# EAGLE design stm32f407 (EAGLE 9.6.2)
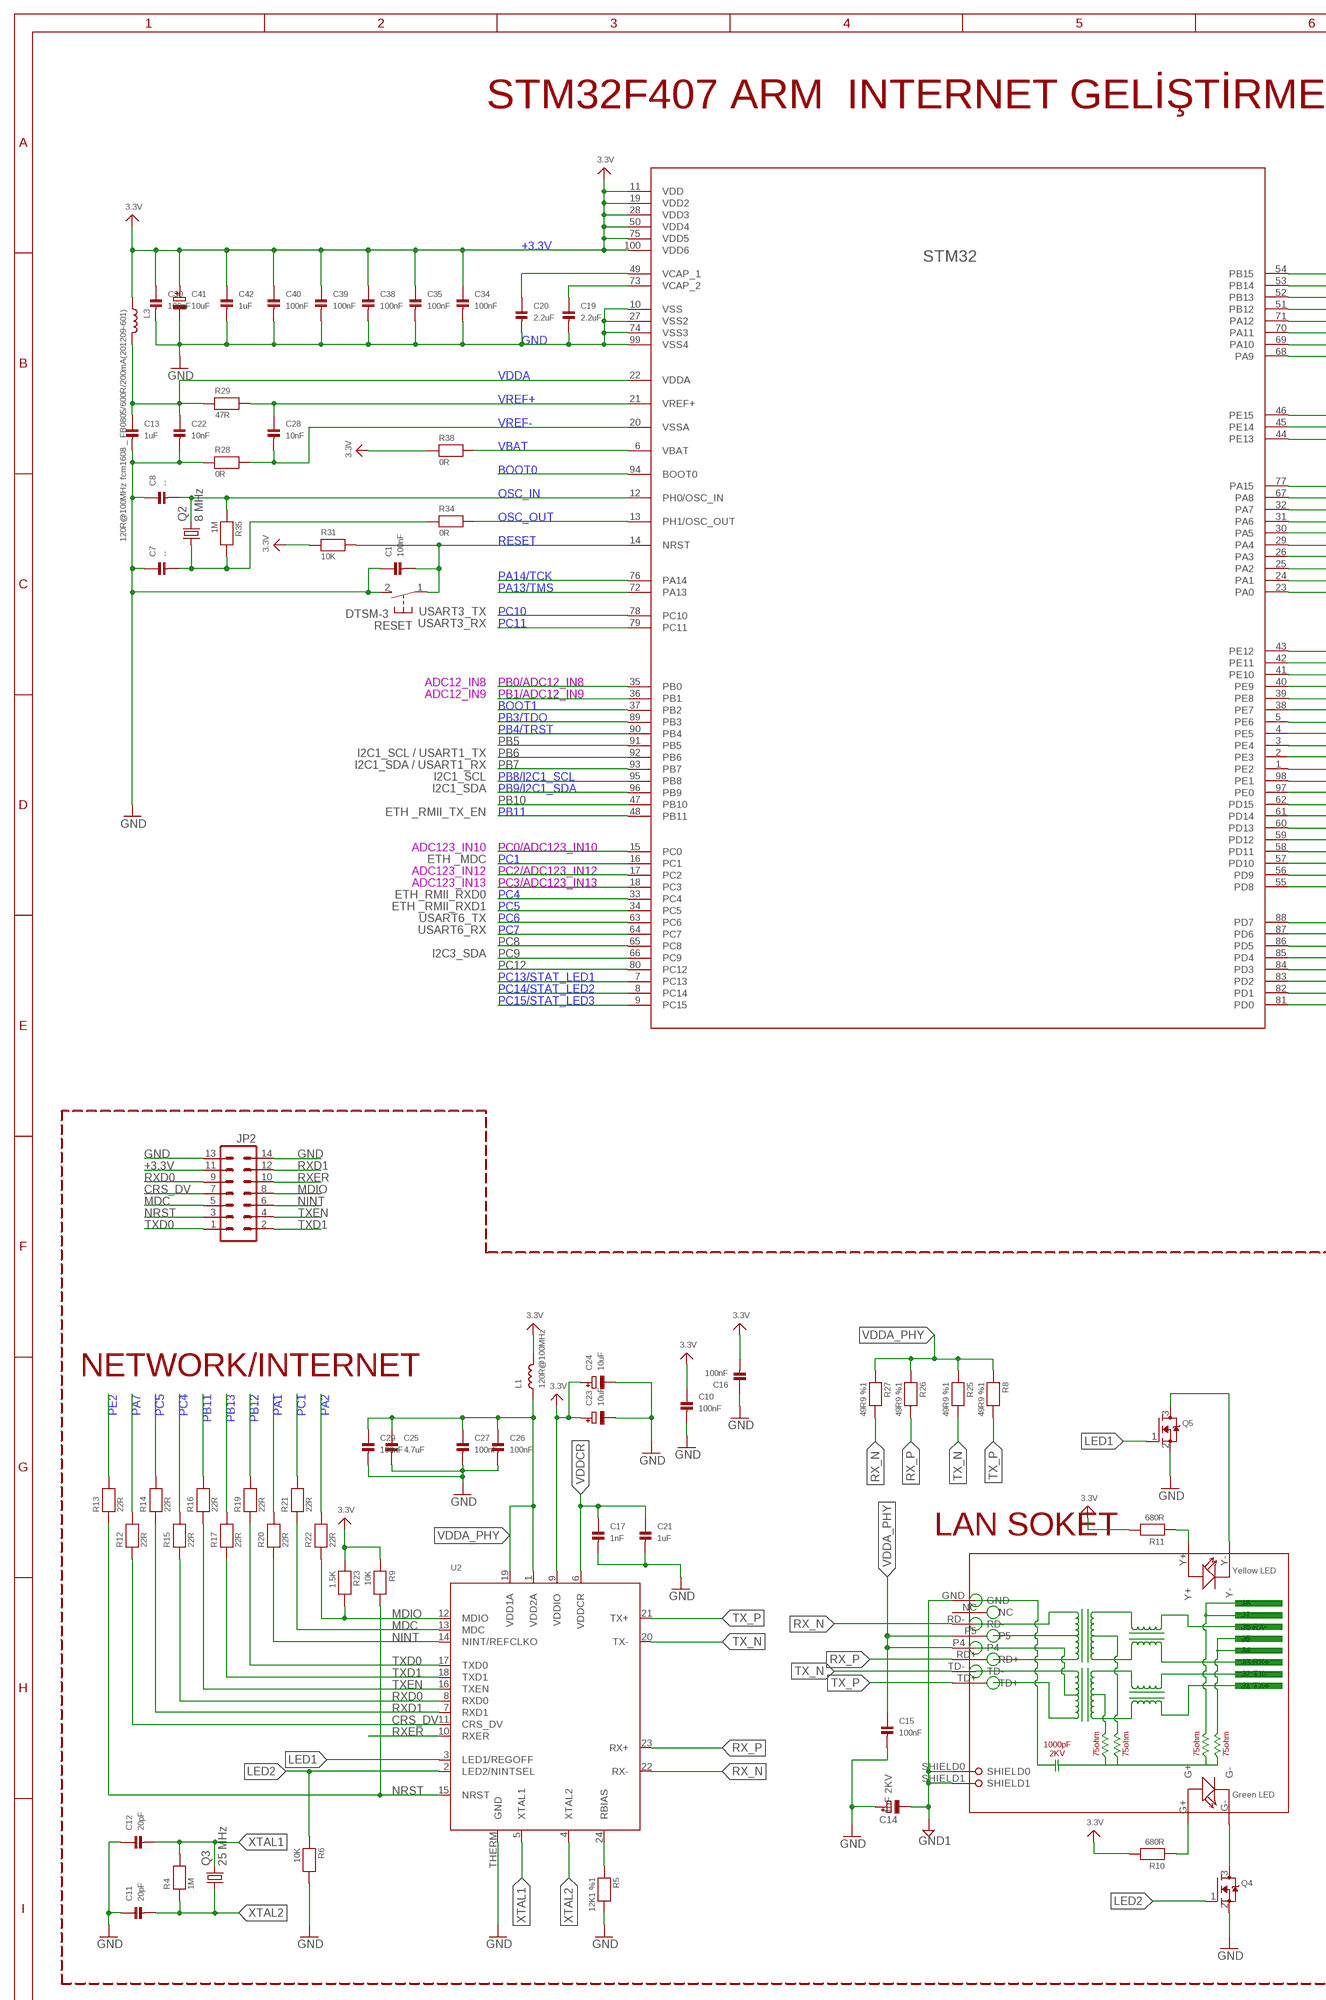
[diagram p0: schematic, sheet 1, part 1 of 2]
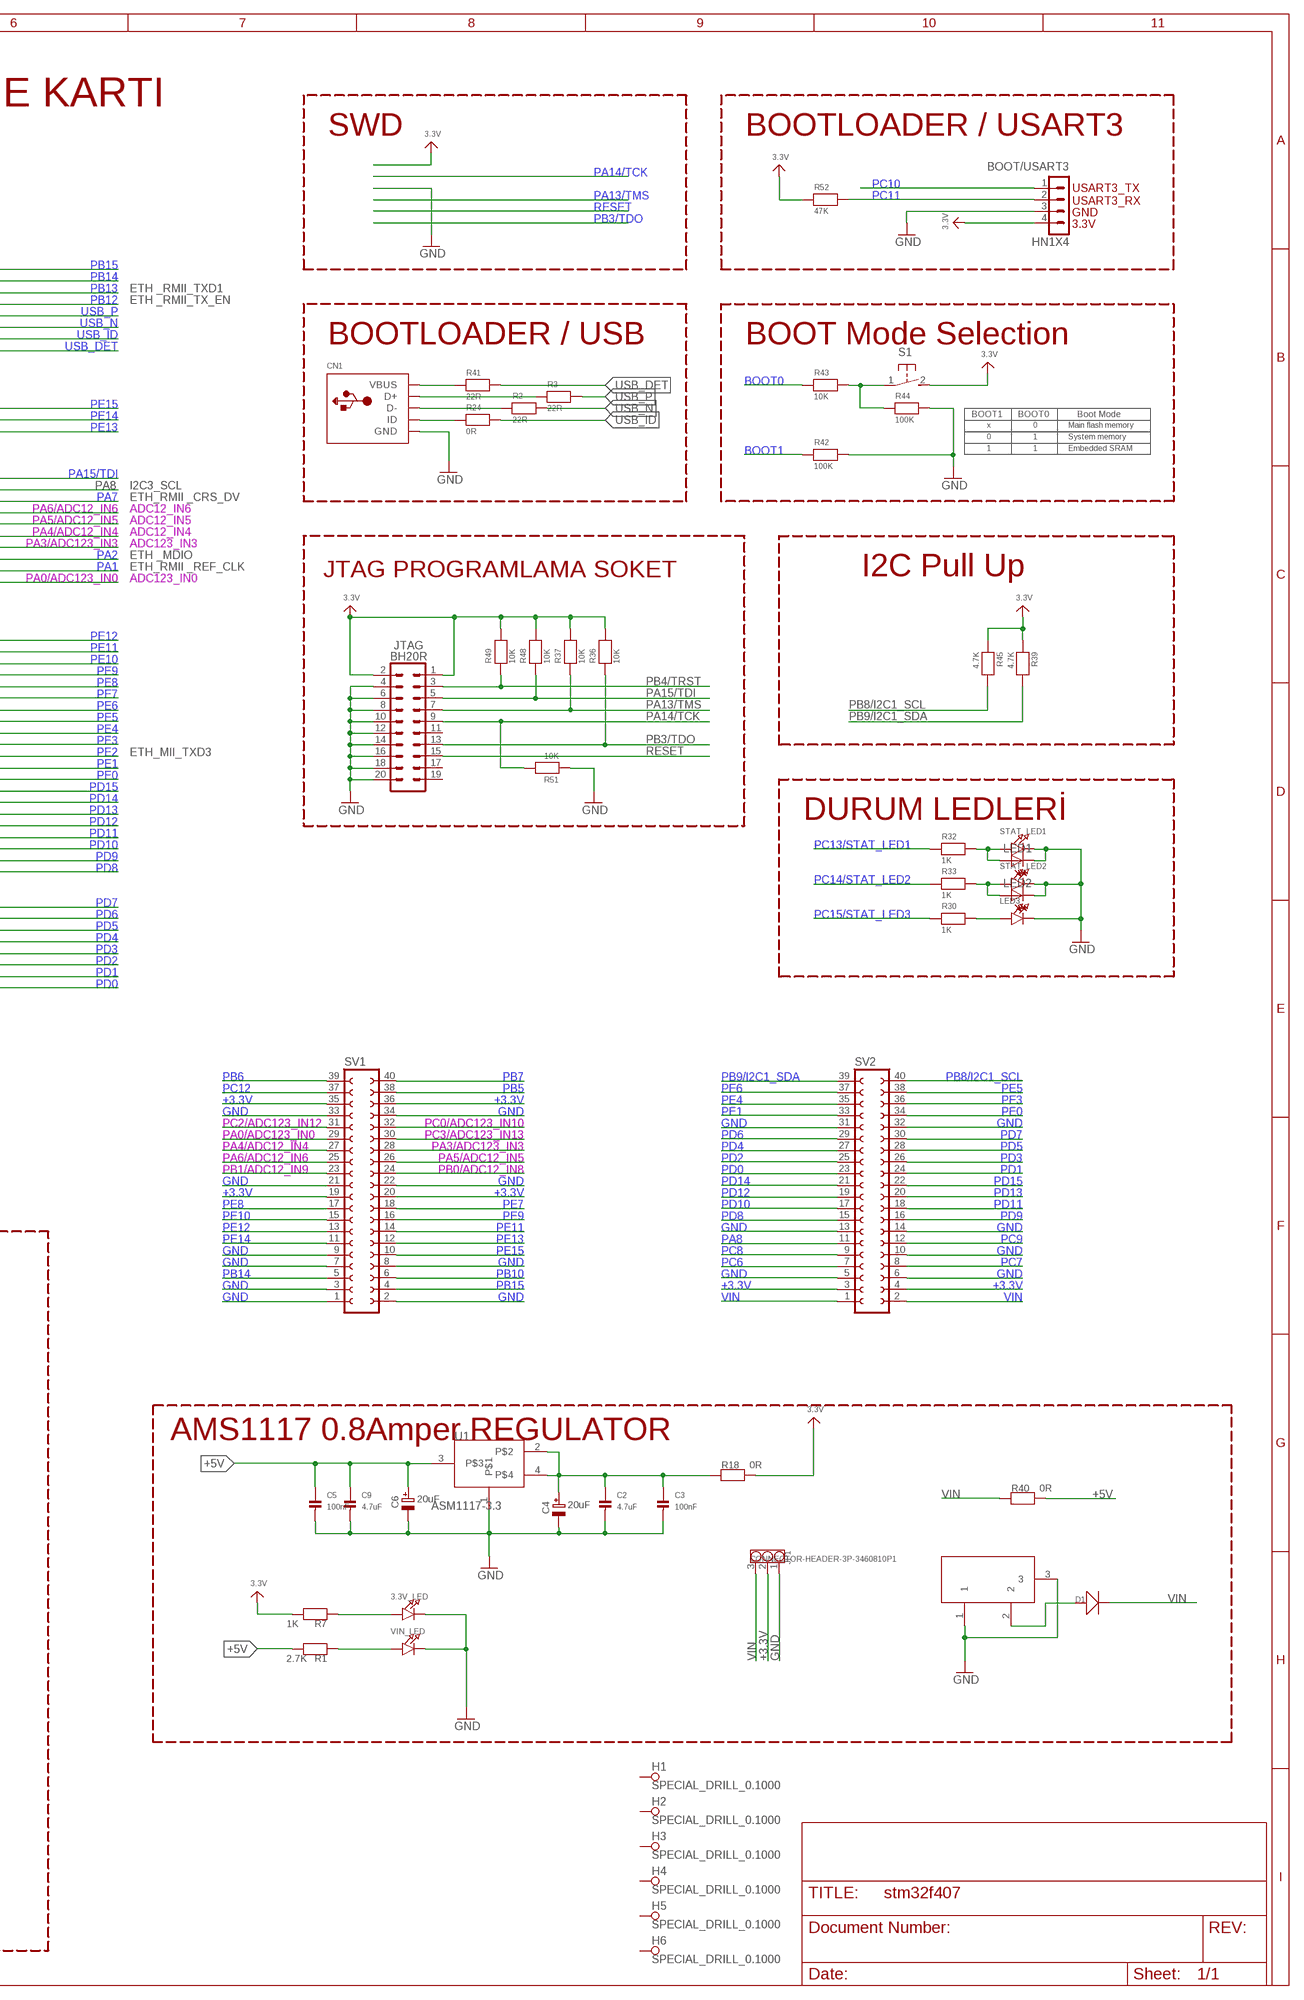
[diagram p1: schematic, sheet 1, part 2 of 2]

## Parts
3.3V_LED  LED0805  [CHIPLED_0805]
BOOT/USART3  HN1X4  CON4HN1X4  [HN1X4]
C1  100nF  CAP_CERAMIC_0603  [_0603]
C2  4.7uF  CAP_CERAMIC0805  [0805]
C3  100nF  CAP_CERAMIC0805  [0805]
C4  20uF  CAP_TANTALUMB/3528_REFLOW  [EIA3528-21/B-R]
C5  100nF  CAP_CERAMIC0805  [0805]
C6  20uF  CAP_TANTALUMB/3528_REFLOW  [EIA3528-21/B-R]
C7  --  CAP_CERAMIC_0603  [_0603]
C8  --  CAP_CERAMIC_0603  [_0603]
C9  4.7uF  CAP_CERAMIC0805  [0805]
C10  100nF  CAP_CERAMIC_0603  [_0603]
C11  20pF  CAP_CERAMIC_0603  [_0603]
C12  20pF  CAP_CERAMIC_0603  [_0603]
C13  1uF  CAP_CERAMIC_0805  [_0805]
C14  1nF 2KV  CAP_TANTALUMB/3528_REFLOW  [EIA3528-21/B-R]
C15  100nF  CAP_CERAMIC_0805  [_0805]
C16  100nF  CAP_CERAMIC_0603  [_0603]
C17  1nF  CAP_CERAMIC_0603  [_0603]
C19  2.2uF  CAP_CERAMIC1206  [1206]
C20  2.2uF  CAP_CERAMIC1206  [1206]
C21  1uF  CAP_CERAMIC_0805  [_0805]
C22  10nF  CAP_CERAMIC_0603  [_0603]
C23  10uF  CAP_TANTALUMB/3528_REFLOW  [EIA3528-21/B-R]
C24  10uF  CAP_TANTALUMB/3528_REFLOW  [EIA3528-21/B-R]
C25  4.7uF  CAP_CERAMIC_0805  [_0805]
C26  100nF  CAP_CERAMIC_0603  [_0603]
C27  100nF  CAP_CERAMIC_0603  [_0603]
C28  10nF  CAP_CERAMIC_0603  [_0603]
C29  100nF  CAP_CERAMIC_0603  [_0603]
C30  100nF  CAP_CERAMIC_0603  [_0603]
C34  100nF  CAP_CERAMIC_0603  [_0603]
C35  100nF  CAP_CERAMIC_0603  [_0603]
C38  100nF  CAP_CERAMIC_0603  [_0603]
C39  100nF  CAP_CERAMIC_0603  [_0603]
C40  100nF  CAP_CERAMIC_0603  [_0603]
C41  10uF  CAP_TANTALUMB/3528_REFLOW  [EIA3528-21/B-R]
C42  1uF  CAP_CERAMIC_0805  [_0805]
CN1  USBMINIBLARGE  [USB-MINIB_LARGER]
D1  D-D1206  [LL-34]
H1  SPECIAL_DRILL_0.1000  [PAD_0.1000]
H2  SPECIAL_DRILL_0.1000  [PAD_0.1000]
H3  SPECIAL_DRILL_0.1000  [PAD_0.1000]
H4  SPECIAL_DRILL_0.1000  [PAD_0.1000]
H5  SPECIAL_DRILL_0.1000  [PAD_0.1000]
H6  SPECIAL_DRILL_0.1000  [PAD_0.1000]
JP1  CONNECTOR-HEADER-3P-3460810P1  [1X3P-2.54-2.54-11.6-3.0-BLACK-MALE]
JP2  MA07-2  [MA07-2]
JTAG  BH20R  ML20R  [BH20R]
L1  120R@100MHz  INDUCTOR_0805  [_0805]
L3  120R@100MHz fcm1608 _ FB0805/600R/200mA(201209-601)  INDUCTOR_0805  [_0805]
LED1  LED5MM  [LED5MM]
LED2  LED5MM  [LED5MM]
LED3  LED0805  [CHIPLED_0805]
Q2  8 MHz  CRYSTALHC49UP  [HC49UP]
Q3  25 MHz  CRYSTALHC49UP  [HC49UP]
Q4  MOSFET-NWIDE  [SOT23-WIDE]
Q5  MOSFET-NWIDE  [SOT23-WIDE]
R1  2.7K  RESISTOR_0603  [_0603]
R2  22R  RESISTOR_0603  [_0603]
R3  22R  RESISTOR_0603  [_0603]
R4  1M  RESISTOR_0603  [_0603]
R5  12K1 %1  RESISTOR_0603  [_0603]
R6  10K  RESISTOR_0603  [_0603]
R7  1K  RESISTOR_0603  [_0603]
R8  49R9 %1  RESISTOR_0603  [_0603]
R9  10K  RESISTOR_0603  [_0603]
R10  680R  RESISTOR_0805  [_0805]
R11  680R  RESISTOR_0805  [_0805]
R12  22R  RESISTOR_0603  [_0603]
R13  22R  RESISTOR_0603  [_0603]
R14  22R  RESISTOR_0603  [_0603]
R15  22R  RESISTOR_0603  [_0603]
R16  22R  RESISTOR_0603  [_0603]
R17  22R  RESISTOR_0603  [_0603]
R18  0R  RESISTOR0805  [0805]
R19  22R  RESISTOR_0603  [_0603]
R20  22R  RESISTOR_0603  [_0603]
R21  22R  RESISTOR_0603  [_0603]
R22  22R  RESISTOR_0603  [_0603]
R23  1.5K  RESISTOR_0603  [_0603]
R24  0R  RESISTOR_0603  [_0603]
R25  49R9 %1  RESISTOR_0603  [_0603]
R26  49R9 %1  RESISTOR_0603  [_0603]
R27  49R9 %1  RESISTOR_0603  [_0603]
R28  0R  RESISTOR_0603  [_0603]
R29  47R  RESISTOR_0603  [_0603]
R30  1K  RESISTOR_0603  [_0603]
R31  10K  RESISTOR_0603  [_0603]
R32  1K  RESISTOR_0603  [_0603]
R33  1K  RESISTOR_0603  [_0603]
R34  0R  RESISTOR_0603  [_0603]
R35  1M  RESISTOR_0603  [_0603]
R36  10K  RESISTOR_0603  [_0603]
R37  10K  RESISTOR_0603  [_0603]
R38  0R  RESISTOR_0603  [_0603]
R39  4.7K  RESISTOR1206  [1206]
R40  0R  RESISTOR0805  [0805]
R41  22R  RESISTOR_0603  [_0603]
R42  100K  RESISTOR_0603  [_0603]
R43  10K  RESISTOR_0603  [_0603]
R44  100K  RESISTOR_0603  [_0603]
R45  4.7K  RESISTOR1206  [1206]
R48  10K  RESISTOR_0603  [_0603]
R49  10K  RESISTOR_0603  [_0603]
R51  10K  RESISTOR_0603  [_0603]
R52  47K  RESISTOR_0603  [_0603]
RESET  DTSM-3  [DTSM-3]
RJ1  HR911105A  [HR911105A]
S1  31-XX  [B3F-31XX]
STAT_LED1  LED0805  [CHIPLED_0805]
STAT_LED2  LED0805  [CHIPLED_0805]
STM32  STM32F407  [100LQFP]
SV1  FE20-2  [FE20-2]
SV2  FE20-2  [FE20-2]
U1  ASM1117-3.3  [SOT223]
U2  LAN8720  [QFN24_4MM]
VIN_LED  LED0805  [CHIPLED_0805]
X1  DC21MMX  [DC-21MM]

## Nets
+3.3V: BOOT/USART3.4 C10.1 C16.2 C23.+ C24.+ C30.1 C34.1 C35.1 C38.1 C39.1 C40.1 C41.+ C42.1 JP1.2 JP2.11 JTAG.1 JTAG.2 L1.2 L3.1 R7.2 R9.1 R10.2 R11.2 R18.2 R23.1 R31.1 R36.2 R37.2 R38.1 R39.1 R45.1 R48.2 R49.2 R52.1 S1.2(S) STM32.11(VDD) STM32.19(VDD2) STM32.28(VDD3) STM32.50(VDD4) STM32.75(VDD5) STM32.100(VDD6) SV1.19 SV1.20 SV1.35 SV1.36 SV2.3 SV2.4 U2.9(VDDIO) ; supply symbol labelled 3.3V
+5V: C5.1 C6.+ C9.1 R1.2 R40.2 U1.3
BOOT0: R43.1 STM32.94(BOOT0)
BOOT1: R42.1 STM32.37(PB2)
CRS_DV: JP2.7 R12.1 U2.11(CRS_DV)
GND: 3.3V_LED.C BOOT/USART3.3 C1.1 C2.2 C3.2 C4.- C5.2 C6.- C7.1 C8.1 C9.2 C10.2 C11.1 C12.1 C13.2 C14.+ C15.2 C16.1 C17.2 C19.2 C20.2 C21.2 C22.2 C23.- C24.- C25.2 C26.2 C27.2 C29.2 C30.2 C34.2 C35.2 C38.2 C39.2 C40.2 C41.- C42.2 CN1.GND JP1.1 JP2.13 JP2.14 JTAG.4 JTAG.6 JTAG.8 JTAG.10 JTAG.12 JTAG.14 JTAG.16 JTAG.18 JTAG.20 LED1.K(C) LED2.K(C) LED3.C Q4.2(S) Q5.2(S) R5.2 R6.2 R28.1 R42.2 R44.2 R51.1 RESET.2 STAT_LED1.C STAT_LED2.C STM32.10(VSS) STM32.27(VSS2) STM32.74(VSS3) STM32.99(VSS4) SV1.1 SV1.2 SV1.3 SV1.7 SV1.8 SV1.9 SV1.21 SV1.22 SV1.33 SV1.34 SV2.5 SV2.6 SV2.10 SV2.13 SV2.14 SV2.31 SV2.32 U1.1 U2.THERM(GND) VIN_LED.C X1.1 X1.3
GND1: C14.- RJ1.GND RJ1.SHIELD0 RJ1.SHIELD1
LED1: Q5.1(G) U2.3(LED1/REGOFF)
LED2: Q4.1(G) R6.1 U2.2(LED2/NINTSEL)
MDC: JP2.5 R21.1 U2.13(MDC)
MDIO: JP2.8 R22.1 R23.2 U2.12(MDIO)
N$1: LED1.A R32.2 STAT_LED1.A
N$2: LED2.A R33.2 STAT_LED2.A
N$3: CN1.VBUS R41.1
N$4: LED3.A R30.2
N$5: D1.A(+) X1.2
N$6: C2.1 C3.1 C4.+ R18.1 U1.2 U1.4
N$7: 3.3V_LED.A R7.1
N$8: R43.2 R44.1 S1.1(P)
N$9: CN1.ID R24.1
N$10: R1.1 VIN_LED.A
N$11: CN1.D+ R3.1
N$12: R5.1 U2.24(RBIAS)
N$13: R10.1 RJ1.G+
N$14: R11.1 RJ1.Y+
N$27: Q4.3(D) RJ1.G-
N$28: Q5.3(D) RJ1.Y-
N$29: CN1.D- R2.1
N$35: C19.1 STM32.73(VCAP_2)
N$36: C20.1 STM32.49(VCAP_1)
N$45: C7.2 Q2.1 R34.1 R35.2
NINT: JP2.6 R20.1 U2.14(NINT/REFCLKO)
NRST: JP2.3 R9.2 R13.1 U2.15(NRST)
OSC_IN: C8.2 Q2.2 R35.1 STM32.12(PH0/OSC_IN)
OSC_OUT: R34.2 STM32.13(PH1/OSC_OUT)
PA0/ADC123_IN0: STM32.23(PA0) SV1.29
PA1: R20.2 STM32.24(PA1)
PA2: R22.2 STM32.25(PA2)
PA3/ADC123_IN3: STM32.26(PA3) SV1.28
PA4/ADC12_IN4: STM32.29(PA4) SV1.27
PA5/ADC12_IN5: STM32.30(PA5) SV1.26
PA6/ADC12_IN6: STM32.31(PA6) SV1.25
PA7: R12.2 STM32.32(PA7)
PA8: STM32.67(PA8) SV2.11
PA13/TMS: JTAG.7 R37.1 STM32.72(PA13)
PA14/TCK: JTAG.9 R51.2 STM32.76(PA14)
PA15/TDI: JTAG.5 R48.1 STM32.77(PA15)
PB0/ADC12_IN8: STM32.35(PB0) SV1.24
PB1/ADC12_IN9: STM32.36(PB1) SV1.23
PB3/TDO: JTAG.13 R36.1 STM32.89(PB3)
PB4/TRST: JTAG.3 R49.1 STM32.90(PB4)
PB5: STM32.91(PB5) SV1.38
PB6: STM32.92(PB6) SV1.39
PB7: STM32.93(PB7) SV1.40
PB8/I2C1_SCL: R45.2 STM32.95(PB8) SV2.40
PB9/I2C1_SDA: R39.2 STM32.96(PB9) SV2.39
PB10: STM32.47(PB10) SV1.6
PB11: R16.2 STM32.48(PB11)
PB12: R19.2 STM32.51(PB12)
PB13: R17.2 STM32.52(PB13)
PB14: STM32.53(PB14) SV1.5
PB15: STM32.54(PB15) SV1.4
PC0/ADC123_IN10: STM32.15(PC0) SV1.32
PC1: R21.2 STM32.16(PC1)
PC2/ADC123_IN12: STM32.17(PC2) SV1.31
PC3/ADC123_IN13: STM32.18(PC3) SV1.30
PC4: R15.2 STM32.33(PC4)
PC5: R14.2 STM32.34(PC5)
PC6: STM32.63(PC6) SV2.7
PC7: STM32.64(PC7) SV2.8
PC8: STM32.65(PC8) SV2.9
PC9: STM32.66(PC9) SV2.12
PC10: BOOT/USART3.1 STM32.78(PC10)
PC11: BOOT/USART3.2 R52.2 STM32.79(PC11)
PC12: STM32.80(PC12) SV1.37
PC13/STAT_LED1: R32.1 STM32.7(PC13)
PC14/STAT_LED2: R33.1 STM32.8(PC14)
PC15/STAT_LED3: R30.1 STM32.9(PC15)
PD0: STM32.81(PD0) SV2.23
PD1: STM32.82(PD1) SV2.24
PD2: STM32.83(PD2) SV2.25
PD3: STM32.84(PD3) SV2.26
PD4: STM32.85(PD4) SV2.27
PD5: STM32.86(PD5) SV2.28
PD6: STM32.87(PD6) SV2.29
PD7: STM32.88(PD7) SV2.30
PD8: STM32.55(PD8) SV2.15
PD9: STM32.56(PD9) SV2.16
PD10: STM32.57(PD10) SV2.17
PD11: STM32.58(PD11) SV2.18
PD12: STM32.59(PD12) SV2.19
PD13: STM32.60(PD13) SV2.20
PD14: STM32.61(PD14) SV2.21
PD15: STM32.62(PD15) SV2.22
PE0: STM32.97(PE0) SV2.34
PE1: STM32.98(PE1) SV2.33
PE2: R13.2 STM32.1(PE2)
PE3: STM32.2(PE3) SV2.36
PE4: STM32.3(PE4) SV2.35
PE5: STM32.4(PE5) SV2.38
PE6: STM32.5(PE6) SV2.37
PE7: STM32.38(PE7) SV1.18
PE8: STM32.39(PE8) SV1.17
PE9: STM32.40(PE9) SV1.16
PE10: STM32.41(PE10) SV1.15
PE11: STM32.42(PE11) SV1.14
PE12: STM32.43(PE12) SV1.13
PE13: STM32.44(PE13) SV1.12
PE14: STM32.45(PE14) SV1.11
PE15: STM32.46(PE15) SV1.10
RESET: C1.2 JTAG.15 R31.2 RESET.1 STM32.14(NRST)
RX_N: R27.2 RJ1.RD- U2.22(RX-)
RX_P: R26.2 RJ1.RD+ U2.23(RX+)
RXD0: JP2.9 R15.1 U2.8(RXD0)
RXD1: JP2.12 R14.1 U2.7(RXD1)
RXER: JP2.10 U2.10(RXER)
TX_N: R25.2 RJ1.TD- U2.20(TX-)
TX_P: R8.2 RJ1.TD+ U2.21(TX+)
TXD0: JP2.1 R19.1 U2.17(TXD0)
TXD1: JP2.2 R17.1 U2.18(TXD1)
TXEN: JP2.4 R16.1 U2.16(TXEN)
USB_DET: R41.2 STM32.68(PA9)
USB_ID: R24.2 STM32.69(PA10)
USB_N: R2.2 STM32.70(PA11)
USB_P: R3.2 STM32.71(PA12)
VBAT: R38.2 STM32.6(VBAT)
VDDA: C13.1 C22.1 L3.2 R29.1 STM32.22(VDDA)
VDDA_PHY: C15.1 C25.1 C26.1 C27.1 C29.1 L1.1 R8.1 R25.1 R26.1 R27.1 RJ1.P4 RJ1.P5 U2.1(VDD2A) U2.19(VDD1A)
VDDCR: C17.1 C21.1 U2.6(VDDCR)
VIN: D1.C(-) JP1.3 R40.1 SV2.1 SV2.2
VREF+: C28.1 R29.2 STM32.21(VREF+)
VREF-: C28.2 R28.2 STM32.20(VSSA)
XTAL1: C12.2 Q3.2 R4.2 U2.5(XTAL1)
XTAL2: C11.2 Q3.1 R4.1 U2.4(XTAL2)
Unconnected: H1.1 H2.1 H3.1 H4.1 H5.1 H6.1 JTAG.11 JTAG.17 JTAG.19 RJ1.NC

## Notes on the sheet
- STM32F407 ARM  INTERNET GELİŞTİRME KARTI
- SWD | BOOTLOADER / USART3
- USART3_TX
- USART3_RX
- GND
- 3.3V
- ETH _RMII_TXD1
- ETH _RMII_TX_EN
- BOOTLOADER / USB | BOOT Mode Selection
- BOOT1 | BOOT0 | Boot Mode
- x | 0 | Main flash memory
- 0 | 1 | System memory
- 1 | 1 | Embedded SRAM
- I2C3_SCL
- ETH_RMII _CRS_DV
- ADC12_IN6
- ADC12_IN5
- ADC12_IN4
- ADC123_IN3
- ETH _MDIO
- ETH_RMII _REF_CLK
- JTAG PROGRAMLAMA SOKET | I2C Pull Up
- ADC123_IN0
- USART3_TX
- USART3_RX
- ADC12_IN8
- ADC12_IN9
- I2C1_SCL / USART1_TX
- I2C1_SDA / USART1_RX | ETH_MII_TXD3
- I2C1_SCL
- I2C1_SDA
- ETH _RMII_TX_EN
- DURUM LEDLERİ
- ADC123_IN10
- ETH _MDC
- ADC123_IN12
- ADC123_IN13
- ETH_RMII_RXD0
- ETH _RMII_RXD1
- USART6_TX
- USART6_RX
- I2C3_SDA
- NETWORK/INTERNET
- AMS1117 0.8Amper REGULATOR
- LAN SOKET

## Library data of the parts
3.3V_LED LED3 STAT_LED1 STAT_LED2 VIN_LED = microbuilder:LED: LED
BOOT/USART3 = Penko:CON4
C1-C3 C5 C7-C13 C15-C17 C19-C22 C25-C30 C34 C35 C38-C40 C42 = microbuilder:CAP_CERAMIC: Ceramic Capacitors 0402 - 0402 Surface Mount Capacitors 16pF 50V 5% [Digikey: 445-4899-2-ND] 18pF 50V 5% [Digikey: 490-1281-2-ND] 22pF 50V 5% [Digikey: 490-1283-2-ND] 68pF 50V 5% [Digikey: 490-1289-2-ND] 0.1uF 10V 10% [Digikey: 490-1318-2-ND] 1.0uF 6.3V 10% [Digikey: 490-1320-2-ND] 0603 - 0603 Surface Mount Capacitors 16 pF 50V 5% [Digikey: 445-5051-2-ND] 22 pF 50V [Digikey: PCC220ACVTR-ND] 33 pF 50V 5% [Digikey: 490-1415-1-ND] 56pF 50V 5% [Digikey: 490-1421-1-ND] 220pF 50V 5% [Digikey: 445-1285-1-ND] 680 pF 50V 2200 pF 50V 5% C0G [Digikey: 445-1297-1-ND] 5600 pF 100V 5% X7R [Digikey: 478-3711-1-ND] 0.1 µF 25V 10% [Digikey: PCC2277TR-ND] 0.22 µF 16V 10% X7R [Digikey: 445-1318-1-ND] 1.0 µF 25V 10% [Digikey: 445-5146-2-ND] 0603 - RF Specific 3pF 250V +/-0.1pF RF [Digikey: 712-1347-1-ND] 18 pF 250V 5% [Digikey: 478-3505-1-ND or 712-1322-1-ND] 56 pF 250V 5% C0G RF [Digikey: 490-4867-1-ND] 68 pF 250V RF [Digikey: 490-4868-1-ND] 0805 - 0805 Surface Mount Capacitors 220 pF 250V 2% RF Ceramic Capacitor [Digikey: 712-1398-1-ND] 1000 pF 50V 2% NP0 Ceramic Capacitor [Digikey: 478-3760-1-ND] 0.1 µF 25V 10% Ceramic Capacitor [Digikey: PCC1828TR-ND] 1.0 µF 16V 10% Ceramic Capacitor[Digikey: 490-1691-2-ND] 10.0 µF 10V 10% Ceramic Capacitor[Digikey: 709-1228-1-ND] 10.0 uF 16V 10% Ceramic Capacitor [Digikey: 478-5165-2-ND] 47 uF 6.3V 20% Ceramic Capacitor [Digikey: 587-1779-1-ND or 399-5506-1-ND] 1206 - 1206 Surface Mount Capacitors 47uF 10V 20% Ceramic Capacitor [Digikey: 490-5528-1-ND or 399-5508-1-ND or 445-6010-1-ND] 100uF 6.3V -20%, +80% Y5V Ceramic Capacitor (Digikey: 490-4512-1-ND, Mouser: 81-GRM31CF50J107ZE1L)
C4 C6 C14 C23 C24 C41 = microbuilder:CAP_TANTALUM: Tantalum Capacitors Wave footprints have larger pads and are meant to be used for hand soldering. Reflow footprints are optimised for solder paste and a reflow oven. EIA3216-18/A-[R/W] - Size A / 3216-18 / 1206 footprint 4.7µF 25V 10% Tantalum Capacitor 10µF 16V 10% Tantalum Capacitor [Digikey: 495-2236-2-ND] EIA3528-21/B-[R/W] - Size B / 3528-21 47µF 10V 10% Tantalum Capactior [Digikey: 495-2216-1-ND] EIA6032-28/C-[R/W] - Size C / 6032-28 10µF 35V 20% Tantalum Capacitor [Digikey: 495-2285-1-ND] 100µF 16V 10% Tantalum Capactior [Digikey: 399-5214-1-ND]
CN1 = microbuilder:USB: USB Connectors USBMINIB - Surface Mount Female Mini-B USB Connector 4UConnector: 06564
D1 = OPL Eagle Library:D*: DIODE
H1-H6 = special-drill:SPECIAL_DRILL_: Special drills
JP1 = OPL Eagle Library:CONNECTOR-HEADER-3P
JP2 = con-lstb:MA07-2: PIN HEADER; OC_FARNELL: unknown; OC_NEWARK: unknown
JTAG = con-harting-ml:ML20: HARTING
L1 L3 = microbuilder:INDUCTOR: Inductors 0603: 10nH Ceramic Inductor - microwire antenna/RF (Digikey: 712-1434-2-ND) 0805: 560nH Ceramic Inductor - RF (Digikey: 553-1047-1-ND) 270nH Ceramic Inductor - Q = 40@250MHz, +-5%, 1 Ohm DC Resistance (Digikey: 535-10506-2-ND) 1007 (2518 Metric) SMT: 10µH 10% 250mOhm 820mA 1007 Inductor (Digikey: 587-2189-1-ND) 22µH 10% 500mOhm 580mA 1007 Inductor (Digikey: 587-2190-1-ND) 47µH 10% 950mOhm 420mA 1007 Inductor (Digikey: 587-2191-1-ND) 47µH 5% 100mOhm 1A 1008 Inductor (Digikey: 732-1816-1-ND) 5.0x5.0mm (Taiyo Yuden NR5040 Series) 6.8µH 20% 2.3A 64mOhm Inductor (Digikey: 587-2374-2-ND) 5.0x5.0mm (TDK VLC5045 Series) 4.7µH 20% 3.3A 34mOhm Inductor (Digikey: 445-6526-1-ND) 6.8µH 20% 2.7A 46mOhm Inductor (Digikey: 445-6527-1-ND) 6.0x6.0mm (TDK VLC6045 Series) 4.7µH 20% 3.8A 27mOhm Inductor (Digikey: 445-6538-2-ND) 6.8µH 20% 3A 41mOhm Inductor (Digikey: 445-6540-1-ND) 6.2µH 30% 2.2A 45mOhm Inductor (Digikey: SRR5028-6R2YCT-ND) - Not TDK VLC6045 but footprint should match 6.0x6.0mm (TDK SLF6045 Series) 6.8uH 30% 2A 33mOhm Inductor (Digikey: 445-4572-1-ND, Mouser: 810-SLF645T6R8N2R0PF)
LED1 LED2 = led:LED: LED
Q2 Q3 = crystal:CRYSTAL: CRYSTAL; OC_FARNELL: unknown; OC_NEWARK: unknown
Q4 Q5 = microbuilder:MOSFET-N: N-Channel Mosfet LEGEND VDS: Voltage Drain-Source ID: Drain Current RDS(ON): Drain-Source On-State Resistance VGS(TH): Gate-Source Threshold Voltage CISS: Drain-Source Input Capacitance SOT-23 Name VDS ID RDS(ON) VGS(TH) CISS Order Number 2N7002E 60V 260mA 2.5 Ohm 2.5V @ 250uA 26.7pF @ 25V 2N7002ET1GOSTR-ND BSH103 30V 850mA 400 mOhm 400mV @ 1mA 83pF @ 24V BSH103,235-ND BSS138 60V 320mA 1.6 Ohm 1.5V @ 250uA 50pF @ 10V Mouser: 771-BSS138PW115 DMN2075U-7 20V 4.2A 38 mOhm 1V @ 250 uA 594.3pF @ 10V DMN2075U-7DICT-ND * BSS138 good choice for I2C level-shifting
R1-R45 R48 R49 R51 R52 = microbuilder:RESISTOR: Resistors 0402 - 0402 Surface Mount Package 22 Ohm 1% 1/16W [Digikey: 311-22.0LRTR-ND] 33 Ohm 5% 1/16W 1.0K 5% 1/16W 1.5K 5% 1/16W 2.0K 1% 1/16W 10.0K 1% 1/16W [Digikey: 311-10.0KLRTR-ND] 10.0K 5% 1/16W [Digikey: RMCF0402JT10K0TR-ND] 12.1K 1% 1/16W [Digikey: 311-22.0LRTR-ND] 100.0K 5% 1/16W 0603 - 0603 Surface Mount Package 0 Ohm 1/10 Watt 1% Resistor 15 Ohm 1/10 Watt 1% Resistor 33 Ohm 1/10 Watt 1% Resistor 49.9 Ohm 1/10 Watt 1% Resistor 100 Ohm 1/10 Watt 1% Resistor 150 Ohm 1/10 Watt 1% Resistor 240 Ohm 1/10 Watt 1% Resistor 390 Ohm 1/10 Watt 1% Resistor 560 Ohm 1/10 Watt 1% Resistor 680 Ohm 1/10 Watt 1% Resistor 750 Ohm 1/10 Watt 1% Resistor 1.0K Ohm 1/10 Watt 1% Resistor 1.5K Ohm 1/10 Watt 1% Resistor 2.0K Ohm 1/10 Watt 1% Resistor 2.2K Ohm 1/10 Watt 1% Resistor 3.3K Ohm 1/10 Watt 1% Resistor 4.7K Ohm 1/10 Watt 1% Resistor 10.0K Ohm 1/10 Watt 1% Resistor 12.0K Ohm 1/10 Watt 1% Resistor 12.1K Ohm 1/10 Watt 1% Resistor 20.0K Ohm 1/10 Watt 1% Resistor 33.0K Ohm 1/10 Watt 1% Resistor 100.0K Ohm 1/10 Watt 1% Resistor 0805 - 0805 Surface Mount Package 0 Ohm 1/8 Watt 1% Resistor 33 Ohm 1/8 Watt 1% Resistor 100 Ohm 1/8 Watt 1% Resistor 150 Ohm 1/8 Watt 1% Resistor 200 Ohm 1/8 Watt 1% Resistor 240 Ohm 1/8 Watt 1% Resistor 330 Ohm 1/8 Watt 1% Resistor 390 Ohm 1/8 Watt 1% Resistor 470 Ohm 1/8 Watt 1% Resistor 1.0K Ohm 1/8 Watt 1% Resistor 1.5K Ohm 1/8 Watt 1% Resistor 2.0K Ohm 1/8 Watt 1% Resistor 4.7K Ohm 1/8 Watt 1% Resistor 5.1K Ohm 1/8 Watt 1% Resistor 5.6K Ohm 1/8 Watt 1% Resistor 10.0K Ohm 1/8 Watt 1% Resistor 22.0K Ohm 1/8 Watt 1% Resistor 33.0K Ohm 1/8 Watt 1% Resistor 100K Ohm 1/8 Watt 1% Resistor 1206 - 1206 Surface Mount Package 2012 - 2010 Surface Mount Package 0.11 Ohm 1/2 Watt 1% Resistor - Digikey: RHM.11UCT-ND
RESET = switch-tact:DTSM-3
RJ1 = Itead_BP_110825.lbr:HR911105A: SOC006
S1 = switch-omron:31-XX: OMRON SWITCH; MPN: B3F-3100; OC_FARNELL: 959704; OC_NEWARK: 36M3582
STM32 = BaseApp:STM32F407
SV1 SV2 = con-lsta:FE20-2: FEMALE HEADER; OC_FARNELL: unknown; OC_NEWARK: unknown
U1 = Itead_IC_110429:ASM1117-3.3: ICP006
U2 = microbuilder:LAN8720: LAN8720A 10/100 Ethernet PHY Mouser: 886-LAN8720AI-CP
X1 = powersupply:DC21MM

## Net classes
0 default: width 0.152 mm, drill 0.305 mm, clearance 0.152 mm

## Board
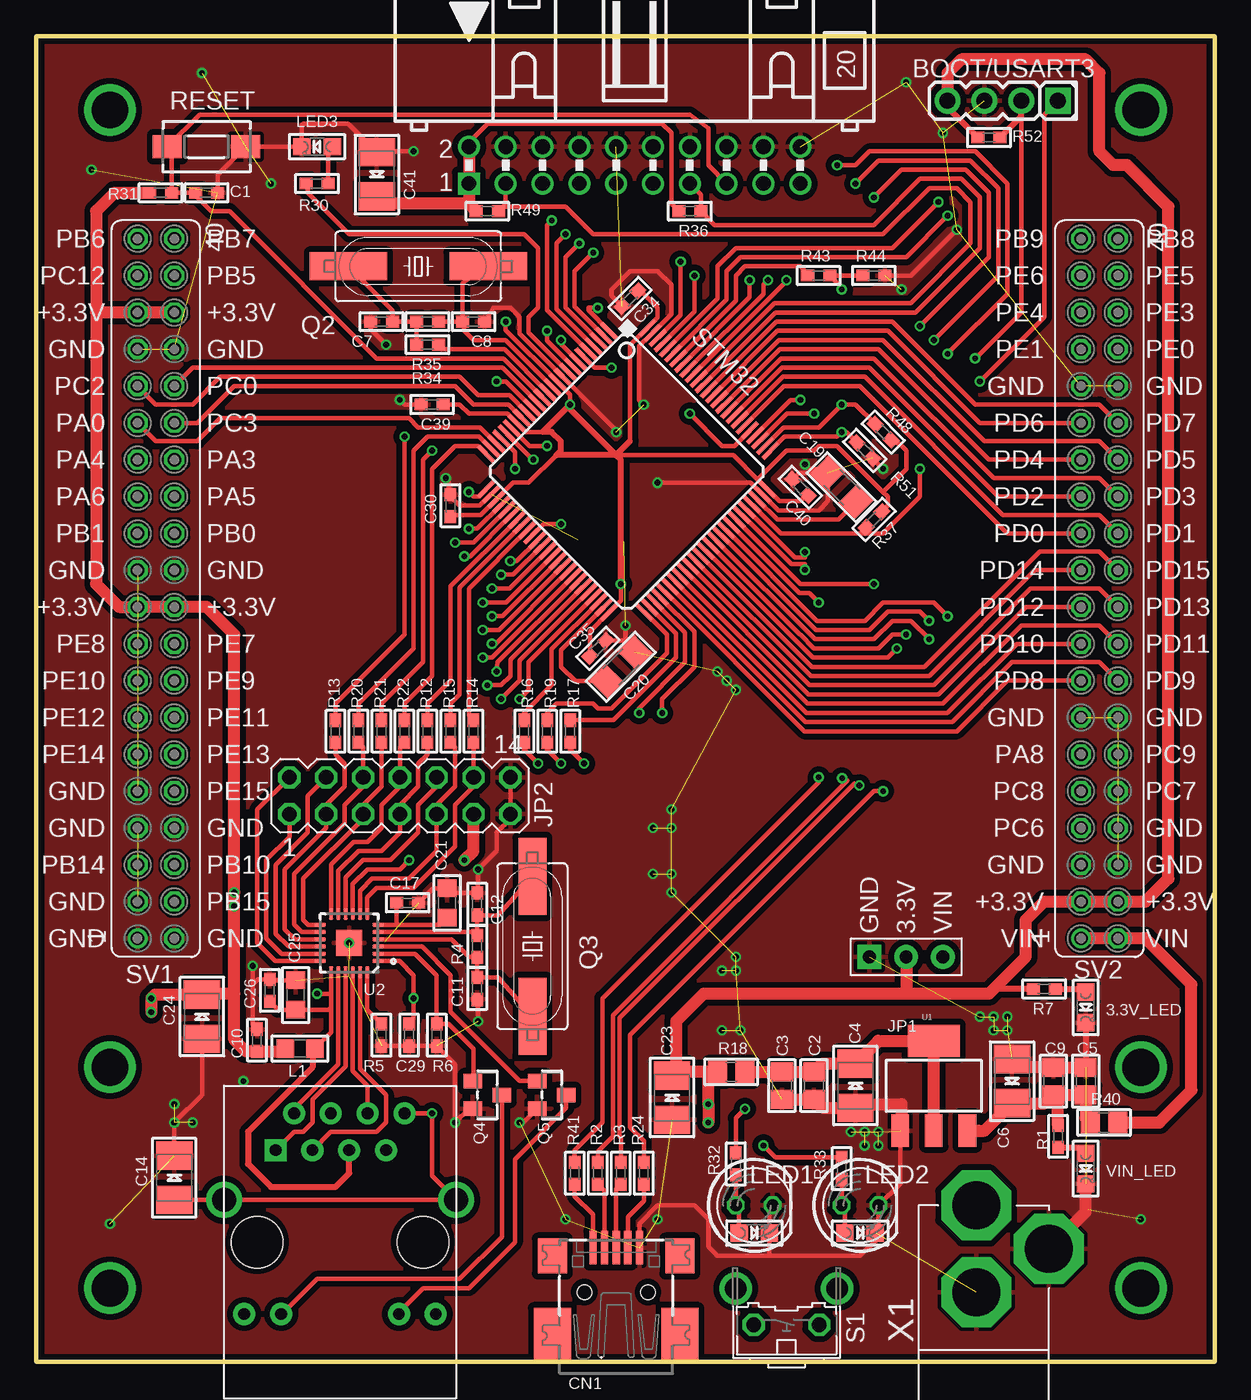
[diagram p2: board, top side]
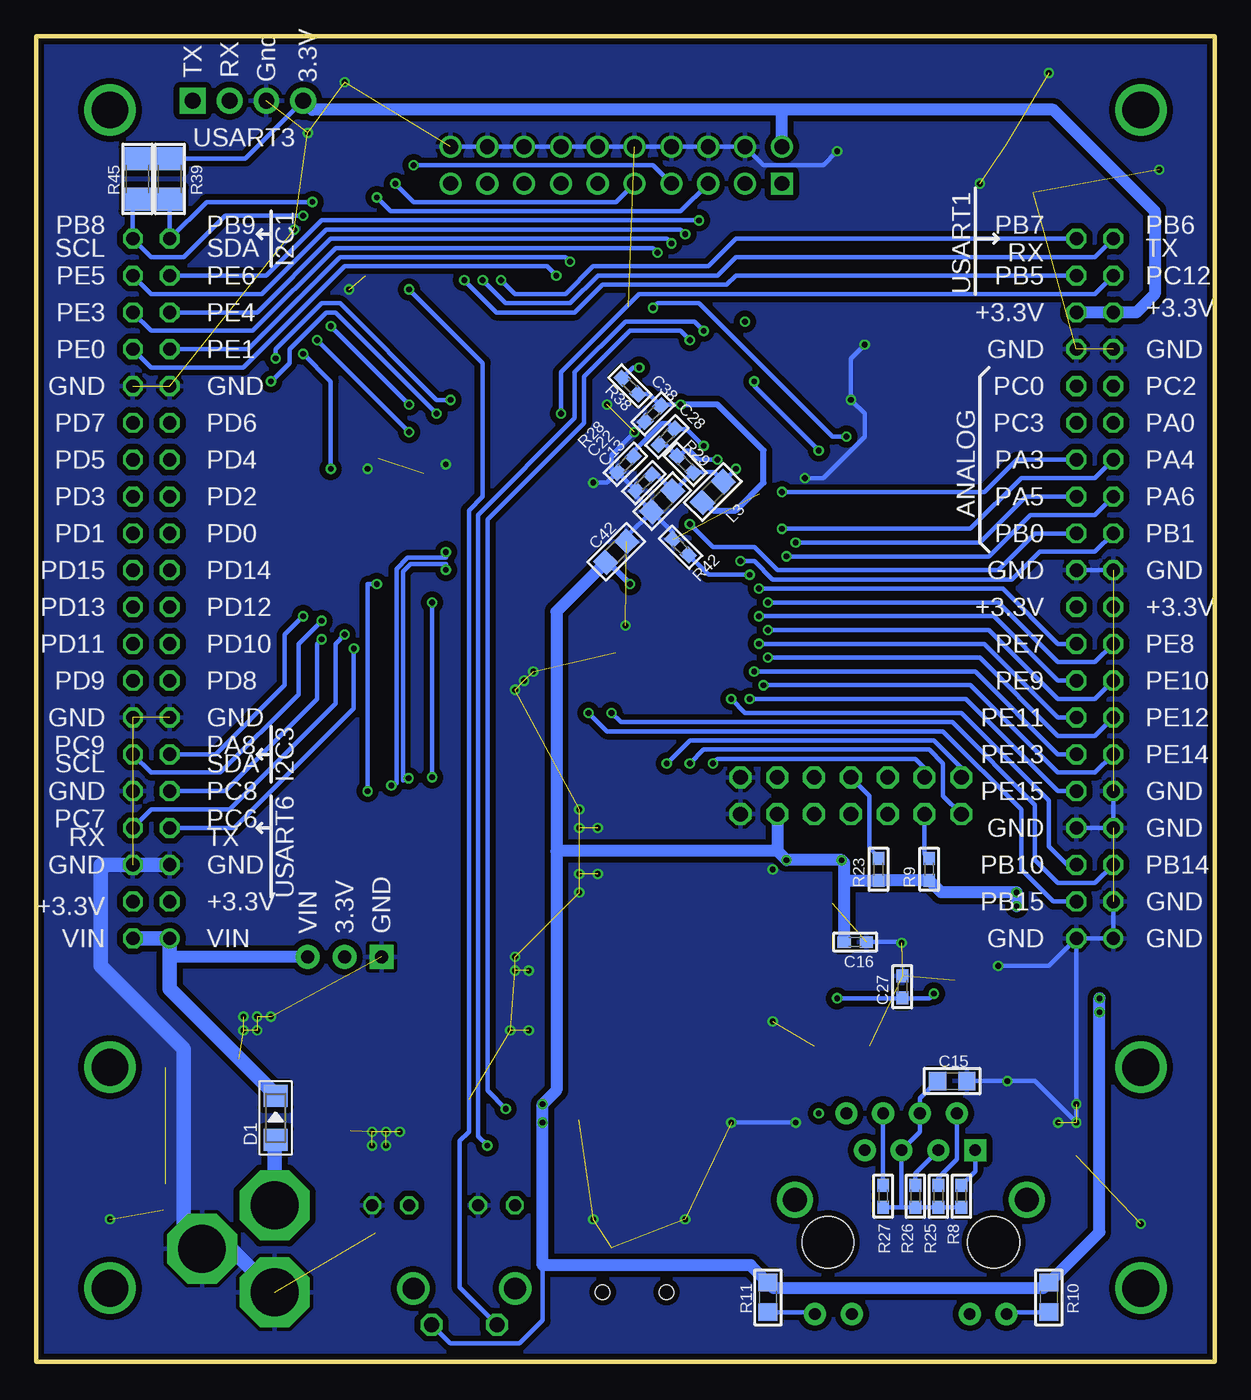
[diagram p3: board, bottom side, seen from below]

Size 81.28 x 91.44 mm. Coordinates in mm from the lower left corner, seen from the top.
Outline: 0,0 81.28,0 81.28,91.44 0,91.44 0,0
Copper layers (1*2*15*16): Top 0.035mm / dielectric 0.2mm / Route2 0.0175mm / dielectric 1.1mm / Route15 0.0175mm / dielectric 0.2mm / Bottom 0.035mm
Design rules "SeeedStudio_DRU_no_angle_20130527": minimum track width 6mil, minimum drill 12mil, track to track 6mil, track to pad 6mil, pad to pad 6mil, via to via 6mil, smd to smd 0mil, copper to edge 10mil, drill to drill 10mil, minimum pad ring 6mil, minimum via ring 6mil, stop-mask expansion 2mil, vias tented up to drill 25mil, thermal gap 10mil

### Footprints (pad centres in the part's own frame; a part is rotated, then mirrored left to right if it is on the bottom)
CHIPLED_0805 = smd 1.2 x 1.2: A 0,-1.05; C 0,1.05
HN1X4 = drill 1.1 pad 1.778 square: 1 -3.81,0 | drill 1.1 pad 1.778: 2 -1.27,0; 3 1.27,0; 4 3.81,0
_0603 = smd 0.9 x 0.8: 1 -0.762,0; 2 0.762,0
0805 = smd 1.3 x 1.5: 1 -0.95,0; 2 0.95,0
EIA3528-21/B-R = smd 1.95 x 2.5: + 1.525,0; - -1.525,0
_0805 = smd 1.2 x 1.3: 1 -1.016,0; 2 1.016,0
1206 = smd 1.6 x 1.8: 1 -1.4,0; 2 1.4,0
USB-MINIB_LARGER = smd 0.5 x 2.308: D+ 0,4.064; D- -0.8,4.064; GND 1.6,4.064; ID 0.8,4.064; VBUS -1.6,4.064 | smd 2.54 x 3.81: GND1 -4.4,-2; GND4 4.4,-2 | smd 2 x 2.4: GND2 -4.4,3.5; GND3 4.4,3.5 | hole 1: -2.2,1; 2.2,1
LL-34 = smd 1.524 x 1.676: A -1.524,0; C 1.524,0
PAD_0.1000 = drill 2.54 pad 2.54: 1 0,0
1X3P-2.54-2.54-11.6-3.0-BLACK-MALE = drill 0.889 pad 1.651 square: 1 0,2.54 | drill 0.889 pad 1.651: 2 0,0; 3 0,-2.54
MA07-2 = drill 1.016 octagon: 1 -7.62,-1.27; 2 -7.62,1.27; 3 -5.08,-1.27; 4 -5.08,1.27; 5 -2.54,-1.27; 6 -2.54,1.27; 7 0,-1.27; 8 0,1.27; 9 2.54,-1.27; 10 2.54,1.27; 11 5.08,-1.27; 12 5.08,1.27; 13 7.62,-1.27; 14 7.62,1.27
BH20R = drill 1.016 square: 1 -11.43,-1.27 | drill 1.016: 2 -11.43,1.27; 3 -8.89,-1.27; 4 -8.89,1.27; 5 -6.35,-1.27; 6 -6.35,1.27; 7 -3.81,-1.27; 8 -3.81,1.27; 9 -1.27,-1.27; 10 -1.27,1.27; 11 1.27,-1.27; 12 1.27,1.27; 13 3.81,-1.27; 14 3.81,1.27; 15 6.35,-1.27; 16 6.35,1.27; 17 8.89,-1.27; 18 8.89,1.27; 19 11.43,-1.27; 20 11.43,1.27
LED5MM = drill 0.813 octagon: A -1.27,0; K 1.27,0
HC49UP = smd 5.334 x 1.93: 1 -4.826,0; 2 4.826,0
SOT23-WIDE = smd 1 x 1.27: 1 -0.95,-1; 2 0.95,-1; 3 0,1
DTSM-3 = smd 2 x 1.6: 1 -2.7,0; 2 2.7,0
HR911105A = drill 0.813 pad 1.524: G+ 4.953,-6.604; G- 4.953,-4.064; GND -8.89,4.445; NC -6.35,3.175; P4 -8.89,-0.635; P5 -6.35,0.635; RD+ -6.35,-1.905; RD- -8.89,1.905; TD- -8.89,-3.175; Y+ 4.953,6.604; Y- 4.953,4.064 | drill 1.651 pad 2.159: SHIELD0 -2.921,8.001; SHIELD1 -2.921,-8.001 | drill 0.813 pad 1.524 square: TD+ -6.35,-4.445 | hole 3.556: 0,-5.715; 0,5.715
B3F-31XX = drill 1.016 octagon: 1 -2.261,-1.245; 2 2.261,-1.245 | drill 1.499 pad 2.159: 3 -3.505,1.245; 4 3.505,1.245
100LQFP = smd 1.5 x 0.3: 1 -6.18,9.08; 2 -6.18,8.58; 3 -6.18,8.08; 4 -6.18,7.58; 5 -6.18,7.08; 6 -6.18,6.58; 7 -6.18,6.08; 8 -6.18,5.58; 9 -6.18,5.08; 10 -6.18,4.58; 11 -6.18,4.08; 12 -6.18,3.58; 13 -6.18,3.08; 14 -6.18,2.58; 15 -6.18,2.08; 16 -6.18,1.58; 17 -6.18,1.08; 18 -6.18,0.58; 19 -6.18,0.08; 20 -6.18,-0.42; 21 -6.18,-0.92; 22 -6.18,-1.42; 23 -6.18,-1.92; 24 -6.18,-2.42; 25 -6.18,-2.92; 51 9.26,-2.92; 52 9.26,-2.42; 53 9.26,-1.92; 54 9.26,-1.42; 55 9.26,-0.92; 56 9.26,-0.42; 57 9.26,0.08; 58 9.26,0.58; 59 9.26,1.08; 60 9.26,1.58; 61 9.26,2.08; 62 9.26,2.58; 63 9.26,3.08; 64 9.26,3.58; 65 9.26,4.08; 66 9.26,4.58; 67 9.26,5.08; 68 9.26,5.58; 69 9.26,6.08; 70 9.26,6.58; 71 9.26,7.08; 72 9.26,7.58; 73 9.26,8.08; 74 9.26,8.58; 75 9.26,9.08 | smd 0.3 x 1.5: 26 -4.46,-4.64; 27 -3.96,-4.64; 28 -3.46,-4.64; 29 -2.96,-4.64; 30 -2.46,-4.64; 31 -1.96,-4.64; 32 -1.46,-4.64; 33 -0.96,-4.64; 34 -0.46,-4.64; 35 0.04,-4.64; 36 0.54,-4.64; 37 1.04,-4.64; 38 1.54,-4.64; 39 2.04,-4.64; 40 2.54,-4.64; 41 3.04,-4.64; 42 3.54,-4.64; 43 4.04,-4.64; 44 4.54,-4.64; 45 5.04,-4.64; 46 5.54,-4.64; 47 6.04,-4.64; 48 6.54,-4.64; 49 7.04,-4.64; 50 7.54,-4.64; 76 7.54,11.1; 77 7.04,11.1; 78 6.54,11.1; 79 6.04,11.1; 80 5.54,11.1; 81 5.04,11.1; 82 4.54,11.1; 83 4.04,11.1; 84 3.54,11.1; 85 3.04,11.1; 86 2.54,11.1; 87 2.04,11.1; 88 1.54,11.1; 89 1.04,11.1; 90 0.54,11.1; 91 0.04,11.1; 92 -0.46,11.1; 93 -0.96,11.1; 94 -1.46,11.1; 95 -1.96,11.1; 96 -2.46,11.1; 97 -2.96,11.1; 98 -3.46,11.1; 99 -3.96,11.1; 100 -4.46,11.1
FE20-2 = drill 0.914: 1 -24.13,1.27 | drill 0.914 octagon: 2 -24.13,-1.27; 3 -21.59,1.27; 4 -21.59,-1.27; 5 -19.05,1.27; 6 -19.05,-1.27; 7 -16.51,1.27; 8 -16.51,-1.27; 9 -13.97,1.27; 10 -13.97,-1.27; 11 -11.43,1.27; 12 -11.43,-1.27; 13 -8.89,1.27; 14 -8.89,-1.27; 15 -6.35,1.27; 16 -6.35,-1.27; 17 -3.81,1.27; 18 -3.81,-1.27; 19 -1.27,1.27; 20 -1.27,-1.27; 21 1.27,1.27; 22 1.27,-1.27; 23 3.81,1.27; 24 3.81,-1.27; 25 6.35,1.27; 26 6.35,-1.27; 27 8.89,1.27; 28 8.89,-1.27; 29 11.43,1.27; 30 11.43,-1.27; 31 13.97,1.27; 32 13.97,-1.27; 33 16.51,1.27; 34 16.51,-1.27; 35 19.05,1.27; 36 19.05,-1.27; 37 21.59,1.27; 38 21.59,-1.27; 39 24.13,1.27; 40 24.13,-1.27
SOT223 = smd 1.219 x 2.235: 1 -2.311,-3.099; 2 0,-3.099; 3 2.311,-3.099 | smd 3.6 x 2.2: 4 0,3.099
QFN24_4MM = smd 0.8 x 0.28: 1 -2,1.25; 2 -2,0.75; 3 -2,0.25; 4 -2,-0.25; 5 -2,-0.75; 6 -2,-1.25; 13 2,-1.25; 14 2,-0.75; 15 2,-0.25; 16 2,0.25; 17 2,0.75; 18 2,1.25 | smd 0.28 x 0.8: 7 -1.25,-2; 8 -0.75,-2; 9 -0.25,-2; 10 0.25,-2; 11 0.75,-2; 12 1.25,-2; 19 1.25,2; 20 0.75,2; 21 0.25,2; 22 -0.25,2; 23 -0.75,2; 24 -1.25,2 | smd 1.778 x 1.778: THERM 0,0
DC-21MM = drill 3.302 pad 4.826 octagon: 1 -5.08,-3.353; 2 -0.076,-6.35; 3 -0.076,-0.356

### Placement (x,y rotation side)
3.3V_LED  72.39,24.45 180 top
BOOT/USART3  66.67,87 180 top
C1  11.75,80.64 180 top
C2  53.66,19.05 270 top
C3  51.44,19.05 270 top
C4  56.52,19.05 90 top
C5  72.39,19.37 90 top
C6  67.31,19.37 270 top
C7  23.81,71.75 0 top
C8  30.16,71.75 180 top
C9  70.17,19.37 90 top
C10  15.22,22.19 90 top
C11  30.41,25.75 90 top
C12  30.41,31.57 270 top
C13  38.1,59.37 225 bottom
C14  9.53,12.7 90 top
C15  18.1,19.37 0 bottom
C16  24.79,28.96 180 bottom
C17  25.62,31.67 0 top
C19  55.56,60.33 135 top
C20  40.32,47.94 45 top
C21  28.34,31.65 90 top
C22  39.37,60.64 225 bottom
C23  43.86,18.23 90 top
C24  11.43,23.81 90 top
C25  17.9,25.3 90 top
C26  16.11,25.62 90 top
C27  21.54,25.87 90 bottom
C28  37.78,63.82 45 bottom
C29  25.72,22.54 270 top
C30  28.57,59.05 90 top
C34  40.96,73.34 225 top
C35  38.73,49.21 45 top
C38  38.73,65.41 225 bottom
C39  27.3,66.04 180 top
C40  52.7,60.33 135 top
C41  23.5,81.92 270 top
C42  41.27,55.88 45 bottom
CN1  40.01,3.81 0 top
D1  64.77,16.83 90 bottom
H1  5.08,5.08 0 top
H2  76.2,5.08 0 top
H3  76.2,86.36 0 top
H4  5.08,86.36 0 top
H5  5.08,20.32 0 top
H6  76.2,20.32 0 top
JP1  60.01,27.94 90 top
JP2  25.08,39.05 0 top
JTAG  41.27,82.55 0 top
L1  18.19,21.61 180 top
L3  34.61,60.01 45 bottom
LED1  49.53,10.79 0 top
LED2  56.83,10.79 0 top
LED3  19.37,83.82 90 top
Q2  26.35,75.56 0 top
Q3  34.22,28.66 90 top
Q4  31.11,18.41 270 top
Q5  35.56,18.41 270 top
R1  70.48,15.56 90 top
R2  38.73,13.02 90 top
R3  40.32,13.02 90 top
R4  30.41,28.66 90 top
R5  23.81,22.54 270 top
R6  27.62,22.54 270 top
R7  69.53,25.72 180 top
R8  17.46,11.43 90 bottom
R9  19.68,33.97 90 bottom
R10  11.43,4.45 90 bottom
R11  30.8,4.45 90 bottom
R12  26.99,43.5 90 top
R13  20.64,43.5 90 top
R14  30.16,43.5 90 top
R15  28.57,43.5 90 top
R16  33.66,43.5 90 top
R17  36.83,43.5 90 top
R18  47.94,20 180 top
R19  35.24,43.5 90 top
R20  22.23,43.5 90 top
R21  23.81,43.5 90 top
R22  25.4,43.5 90 top
R23  23.18,33.97 90 bottom
R24  41.91,13.02 90 top
R25  19.05,11.43 90 bottom
R26  20.64,11.43 90 bottom
R27  22.86,11.43 90 bottom
R28  40.64,61.91 45 bottom
R29  36.51,61.91 135 bottom
R30  19.37,81.28 0 top
R31  8.57,80.64 0 top
R32  48.26,13.65 270 top
R33  55.56,13.34 270 top
R34  26.99,70.17 0 top
R35  26.99,71.75 180 top
R36  45.09,79.38 180 top
R37  57.78,58.1 45 top
R38  40.32,67.31 135 bottom
R39  72.07,81.6 270 bottom
R40  73.66,16.51 180 top
R41  37.15,13.02 90 top
R42  36.83,56.2 135 bottom
R43  53.98,74.93 0 top
R44  57.78,74.93 0 top
R45  74.3,81.6 270 bottom
R48  58.42,64.14 315 top
R49  31.11,79.38 180 top
R51  57.15,62.87 135 top
R52  65.72,84.45 0 top
RESET  11.75,83.82 0 top
RJ1  20.95,8.26 270 top
S1  51.75,3.81 0 top
STAT_LED1  49.53,8.89 270 top
STAT_LED2  56.83,8.89 270 top
STM32  37.47,60.33 315 top
SV1  8.26,53.34 90 top
SV2  73.34,53.34 90 top
U1  61.91,19.05 0 top
U2  21.59,28.89 180 top
VIN_LED  72.39,13.34 180 top
X1  64.77,4.45 180 top

### Tracks (layer width: path | path; a pad name or v marks a point on that pad's centre or on a via)
+3.3V  (via drill 0.4)
  Top 0.305: U2.9 21.84,32.95 22.86,33.97 25.08,33.97 v25.72,34.61 | R36.2 43.81,79.88 43.81,84.77 43.18,85.41 31.11,85.41 29.84,84.14 JTAG.2 | v32.38,71.75 32.38,71.17 STM32.11 36.83,66.73 v36.83,66.04 | 44.13,20.02 C23.+ | 66.36,25.72 66.2,25.88 | C35.1 38.2,50.39 STM32.50 40.32,52.52 v40.32,53.66 | C30.1 28.45,58.29 28.57,58.42 30.67,58.42 STM32.28 32.89,60.64 33.97,60.64 35.88,62.55 | C39.1 29.21,66.04 29.84,65.41 32.5,65.41 STM32.19 33.77,64.14 34.92,64.14 | C34.1 41.69,73.88 42.86,72.71 42.86,72.03 STM32.100 40.96,70.12 40.96,63.5 | C40.1 53.24,59.91 52.7,59.37 51.26,59.37 STM32.75 49.76,60.87 | R37.2 58.74,59.05 58.74,59.69 58.42,60.01 | 58.42,60.01 55.24,63.18 53.98,63.18 53.66,62.87 51.75,62.87 49.76,60.87 | R48.2 59.59,63.28 60.01,62.87 60.01,61.59 58.42,60.01 | 49.76,60.87 48.08,62.55 40.01,62.55 | 11.49,25.4 C24.+ | 62.87,87.44 BOOT/USART3.4
  Top 0.406: R7.2 66.36,25.72 | 40.96,63.5 40.01,62.55 | 40.01,62.55 35.88,62.55 36.2,62.87 36.2,63.5 35.56,64.14 34.92,64.14 v36.83,66.04 36.83,65.72 40.01,62.55 | v40.32,53.66 40.32,62.23 40.01,62.55 | R52.1 62.87,86.55 BOOT/USART3.4
  Top 0.813: v29.53,34.61 30.16,35.24 JP2.11 | 29.84,79.88 JTAG.1 JTAG.2 | 29.84,79.88 R49.2 | 60.01,25.4 65.72,25.4 66.2,25.88 68.26,27.94 68.26,30.48 69.53,31.75 SV2.3 SV2.4 76.52,31.75 78.11,33.34 78.11,79.69 75.25,82.55 74.3,82.55 73.34,83.5 73.34,88.9 72.39,89.85 63.82,89.85 62.87,88.9 BOOT/USART3.4 | 60.01,25.4 46.04,25.4 44.13,23.5 44.13,20.02 46.35,20.02 | 46.35,20.02 46.97,20.02 R18.2 | 13.65,25.4 13.65,22.23 14.45,21.43 C10.1 16.99,21.43 L1.2 | 13.65,25.4 11.49,25.4 | 46.35,20.02 v46.35,17.78 v46.35,16.51 | JP1.2 60.01,25.4 | C24.+ 8.19,25.34 v7.94,25.08 v7.94,24.13 | 13.65,25.4 v13.65,32.38 13.65,50.16 11.75,52.07 SV1.20 SV1.19 5.71,52.07 4.13,53.66 4.13,72.39 | SV1.36 SV1.35 4.13,72.39 | 4.13,72.39 4.13,79.38 5.4,80.64 R31.1 | 29.84,79.88 24,79.88 C41.+
  Bottom 0.305: v25.72,34.61 25.55,34.44 | R23.1 23.15,33.34 | 41.83,55.16 C42.1 | v36.83,66.04 38.1,66.04 C38.1 39.02,66.77 R38.1 | S1.2 52.72,1.27 47.94,1.27 46.35,2.86 46.35,6.67 | BOOT/USART3.4 66.86,83 R39.1 R45.1
  Bottom 0.406: v40.32,53.66 41.83,55.16 | L3.1 35.16,59.29 34.61,58.74 33.02,58.74 31.11,60.64 31.11,62.87 34.29,66.04 v36.83,66.04
  Bottom 0.813: v25.72,34.61 v29.53,34.61 30.16,35.24 | 25.55,34.44 25.55,33.34 | 25.55,33.34 C16.2 | v7.94,25.08 7.94,8.95 R10.2 11.81,5.08 30.42,5.08 R11.2 32,6.67 46.35,6.67 v46.35,17.78 45.4,18.73 45.4,35.24 | 25.55,33.34 25.42,33.21 R23.1 R9.1 18.86,32.38 v13.65,32.38 v13.65,31.43 | JP2.11 30.16,35.24 | C42.1 45.4,51.75 45.4,35.24 | 30.16,35.24 45.4,35.24 | SV1.36 SV1.35 5.4,72.39 4.13,73.66 4.13,79.38 11.11,86.36 29.84,86.36 | 29.84,86.36 62.23,86.36 BOOT/USART3.4 | JTAG.2 29.84,86.36
+5V
  Top 0.813: C9.1 C5.1 72.39,16.83 R40.2 | 65.01,15.95 U1.3 65.42,15.95 C6.+ 69.59,17.84 C9.1 | R1.2 70.48,18.1 C9.1
BOOT0
  Top 0.305: STM32.94 48.26,73.19 48.26,74.93 48.9,75.56 52.7,75.56 53.21,75.06 R43.1
BOOT1  (via drill 0.4)
  Top 0.305: STM32.37 32.9,54.29 v32.07,54.29
  Bottom 0.305: v32.07,54.29 34.92,54.29 36.51,55.88 | 36.51,55.88 | 36.51,55.88 R42.1
CRS_DV
  Top 0.305: U2.11 20.84,33.86 22.23,35.24 23.81,35.24 25.08,36.51 JP2.7 25.08,38.42 26.35,39.69 26.35,41.27 26.99,41.91 R12.1
GND  (via drill 0.4)  (63 unrouted)
  Top 0.305: C5.2 | 72.53,10.48 72.39,10.34 | 67.89,20.32 C6.- | 59.69,16.04 U1.1 59.6,12.29 LED2.K 58.1,9.11 STAT_LED2.C 57.88,8.35 56.83,7.3 50.58,7.3 | C4.- 56.77,17.78 | C7.1 23.05,71.25 v24.13,70.17 | C8.1 31.56,72.71 32.7,72.71 33.34,72.07 33.34,70.93 STM32.10 40.01,64.26 v40.01,64.14 | C1.1 12.51,81.88 RESET.2 LED3.C 18.32,85.31 18.41,85.41 21.53,85.41 C41.- 23.56,83.5 v26.04,83.5 | 40.64,49.6 40.48,49.77 39.29,49.77 C35.2 | C20.2 40.64,49.6 | C17.2 27.38,32.67 C21.2 28.67,32.34 C12.1 30.48,32.4 v30.48,33.97 31.75,35.24 31.75,36.51 32.7,37.47 JP2.13 JP2.14 | C25.2 16.17,26.32 C26.2 15.27,26.38 14.92,26.04 | 14.92,26.04 14.92,23.25 C10.2 | R5.2 C29.2 R6.2 28.89,20.51 v28.89,16.51 29.85,17.46 Q4.2 | 40.64,49.6 v40.64,50.8 | STM32.27 30.59,59.05 29.21,59.05 28.45,59.82 | 28.45,59.82 C30.2 | C39.2 25.4,66.04 v25.08,66.36 | 28.45,59.82 28.45,60.77 v28.26,60.96 | v42.86,60.64 49.28,60.64 STM32.74 51.19,58.74 53.98,58.74 54.61,59.37 54.61,61.59 | 54.61,61.59 arc90 C19.2 52.62,61.31 C40.2 | 54.61,61.59 53.34,61.59 v53.02,61.91 | v41.91,66.04 41.59,66.36 41.59,70.05 STM32.99 43.81,72.28 43.81,74.3 42.86,75.25 40.96,75.25 39.69,73.98 39.69,73.53 C34.2 | C14.+ v9.53,16.51 11.43,18.41 C24.- | Q5.2 33.6,16.51 v33.34,16.51 | C11.1 30.48,24.92 v30.48,23.5 | 14.92,26.04 v14.92,27.3 | LED1.K 50.58,10.57 STAT_LED1.C 50.58,7.3 | CN1.GND 41.6,9.54 42.86,10.79 45.4,10.79 46.35,9.84 46.35,7.94 46.99,7.3 50.58,7.3 | R44.2 60.33,74.93 v63.5,78.11 | R51.1 | R51.1 v58.42,61.59
  Top 0.406: 3.3V_LED.C C5.2
  Top 0.813: X1.1 72.39,10.34 VIN_LED.C | C5.2 C9.2 67.89,20.32 | 59.69,16.04 59.69,17.78 56.77,17.78 | C3.2 C2.2 54.23,17.52 C4.-
  Bottom 0.305: JTAG.20 JTAG.18 JTAG.16 JTAG.14 JTAG.12 JTAG.10 JTAG.8 JTAG.6 JTAG.4 31.11,82.55 26.99,82.55 v26.04,83.5 | U2.THERM 21.66,28.96 C16.1 | v24.13,70.17 25.08,69.22 v25.08,66.36 24.13,65.41 24.13,63.82 26.99,60.96 v28.26,60.96 | C38.2 v40.01,64.14 41.59,62.55 41.59,61.59 41.37,61.37 R28.1 | R28.1 C22.2 39.91,59.74 C13.2 | C13.2 37.37,57.2 R42.2 | C13.2 40.56,56.92 C42.2 | v42.86,60.64 41.91,60.64 R28.1 | C15.2 v14.29,19.37 12.38,19.37 v9.53,16.51 SV1.2 | v33.34,16.51 v28.89,16.51 | v14.92,27.3 11.43,27.3 SV1.2 | SV1.2 SV1.1 SV1.3 | SV1.8 SV1.7 SV1.9 | SV1.22 SV1.21
  Bottom 1.016: X1.3 67.84,7.8 X1.1 71.12,9.07 71.12,21.59 76.83,27.3 76.83,34.29 SV2.6 SV2.5
  other vias: 21.59,28.89 58.1,15.88 57.15,15.88 56.2,15.88 58.1,14.92 57.15,14.92 66.04,22.86 66.99,22.86 65.09,23.81 66.04,23.81 66.99,23.81 59.69,73.98 46.99,47.62 47.62,46.99 48.26,46.35 47.31,26.99 48.26,26.99 48.26,27.94 47.31,22.86 48.58,22.86 43.81,33.66 42.55,33.66 43.81,32.38 43.81,36.83 43.81,38.1 42.55,36.83 62.55,84.77 60.01,88.27 3.81,82.23 11.43,88.9 16.19,81.28 9.53,17.78 10.79,16.51 5.08,9.53 76.2,9.84 36.51,9.84 42.86,9.84
  pour Bottom (isolate 0.406): 0,91.44 0,0 81.28,0 81.28,91.44
  pour Top (isolate 0.406): 0,91.44 0,0 81.28,0 81.92,92.08
GND1  (via drill 0.4)
  Top 0.305: C14.- RJ1.SHIELD1 RJ1.SHIELD0 27.3,12.83 v27.3,17.14 RJ1.GND
LED1
  Top 0.305: U2.3 26.6,28.64 28.57,26.67 28.57,24.13 33.34,19.37 Q5.1
LED2
  Top 0.305: U2.2 26.15,28.14 27.62,26.67 R6.1 28.45,23.3 30.16,21.59 30.16,19.41 Q4.1
MDC
  Top 0.305: U2.13 18.75,30.14 18.41,30.48 18.41,33.34 22.54,37.47 JP2.5 22.54,38.42 23.81,39.69 R21.1
MDIO
  Top 0.305: U2.12 20.34,34.31 21.91,35.88 22.86,35.88 23.81,36.83 23.81,38.42 25.08,39.69 JP2.8 25.08,42.42 R22.1
  Bottom 0.305: R23.2 23.81,35.52 23.81,39.05 JP2.8
N$1
  Top 0.305: R32.2 LED1.A 48.48,10.57 STAT_LED1.A
N$2
  Top 0.305: R33.2 LED2.A 55.78,10.57 STAT_LED2.A
N$3
  Top 0.305: CN1.VBUS 38.41,10.17 37.15,11.43 R41.1
N$4
  Top 0.305: LED3.A 20.13,83.53 R30.2
N$5
  Bottom 0.305: 64.85,15.19 64.77,15.26 D1.A
  Bottom 1.016: X1.2 64.85,15.19
N$6
  Top 0.305: C3.1
  Top 0.813: C3.1 C2.1 54.23,20.57 C4.+ 58.09,22.15 U1.4 U1.2 | R18.1 C3.1
N$7
  Top 0.305: 72.17,25.72 3.3V_LED.A
  Top 0.406: R7.1 72.17,25.72
N$8  (via drill 0.4)
  Top 0.305: R44.1 R43.2 55.56,74.11 v55.56,73.98
  Bottom 0.305: v55.56,73.98 50.48,68.9 50.48,59.69 51.44,58.74 51.44,15.88 52.07,15.24 52.07,5.14 S1.1
N$9
  Top 0.305: CN1.ID 40.8,10.01 41.91,11.11 R24.1
N$10
  Top 0.406: R1.1 71.98,14.8 VIN_LED.A
N$11
  Top 0.305: CN1.D+ 40.01,11.94 R3.1
N$12
  Top 0.305: U2.24 22.84,24.28 R5.1
N$13
  Bottom 0.305: RJ1.G+ 14.22,3.43 R10.1
N$14
  Bottom 0.305: RJ1.Y+ 27.69,3.43 R11.1
N$27
  Top 0.305: Q4.3 32.12,8.62 29.21,5.71 19.37,5.71 16.95,3.3 RJ1.G-
N$28
  Top 0.305: Q5.3 36.56,17.51 33.02,13.97 33.02,8.26 29.84,5.08 26.67,5.08 25.02,3.43 RJ1.Y-
N$29
  Top 0.305: CN1.D- 39.2,11.79 R2.1
N$35
  Top 0.305: STM32.73 51.11,58.1 55.32,58.1 C19.1
N$36
  Top 0.305: STM32.49 36.2,49.1 36.2,47.94 37.19,46.95 C20.1
N$45
  Top 0.305: R34.1 R35.2 C7.2 24.57,72.52 Q2.1
NINT
  Top 0.305: U2.14 18.3,29.64 17.78,30.16 17.78,33.66 21.27,37.15 21.27,38.42 22.54,39.69 JP2.6 22.54,42.42 R20.1
NRST
  Top 0.305: U2.15 17.85,29.14 17.14,29.84 17.14,33.97 20,36.83 JP2.3 20,38.42 21.27,39.69 21.27,41.27 20.64,41.91 R13.1
  Bottom 0.305: R9.2 20,35.05 JP2.3
OSC_IN
  Top 0.305: STM32.12 32.37,70.48 30.16,70.48 29.53,71.12 29.53,71.94 C8.2 | R35.1 C8.2 | C8.2 29.4,74.42 Q2.2
OSC_OUT
  Top 0.305: R34.2 27.94,70.17 27.94,69.85 32.3,69.85 STM32.13
PA0/ADC123_IN0
  Top 0.305: STM32.23 30.62,64.45 26.35,64.45 25.72,65.09 12.7,65.09 11.11,63.5 8.26,63.5 SV1.29
PA1
  Top 0.305: STM32.24 30.55,63.82 26.99,63.82 26.04,62.87 26.04,49.21 22.23,45.4 R20.2
PA2
  Top 0.305: STM32.25 30.48,63.18 28.89,63.18 27.3,61.59 27.3,47.31 25.4,45.4 R22.2
PA3/ADC123_IN3  (via drill 0.4)
  Top 0.305: STM32.26 30.52,59.69 30.16,59.69 v29.84,60.01
  Bottom 0.305: v29.84,60.01 15.88,60.01 13.65,62.23 SV1.28
PA4/ADC12_IN4  (via drill 0.4)
  Top 0.305: STM32.29 30.42,57.47 v29.84,57.47
  Bottom 0.305: v29.84,57.47 16.83,57.47 13.34,60.96 8.26,60.96 SV1.27
PA5/ADC12_IN5  (via drill 0.4)
  Top 0.305: STM32.30 30.18,56.52 v28.89,56.52
  Bottom 0.305: v28.89,56.52 16.19,56.52 13.02,59.69 SV1.26
PA6/ADC12_IN6  (via drill 0.4)
  Top 0.305: STM32.31 29.93,55.56 v29.53,55.56
  Bottom 0.305: v29.53,55.56 15.56,55.56 12.7,58.42 8.26,58.42 SV1.25
PA7
  Top 0.305: STM32.32 28.57,53.5 28.57,46.99 26.99,45.4 R12.2
PA8  (via drill 0.4)
  Top 0.305: STM32.67 53.86,51.12 57.15,51.12 58.42,52.39 61.91,52.39 v62.87,51.44
  Bottom 0.305: v62.87,51.44 64.14,50.16 64.14,46.67 68.9,41.91 SV2.11
PA13/TMS  (via drill 0.4)
  Top 0.305: 57.15,57.47 R37.1 57.25,57.37 57.47,57.15 | STM32.72 51.36,57.15 57.47,57.15 | 57.47,57.15 58.42,57.15 60.96,59.69 v60.96,61.59 | v62.87,69.53 66.99,73.66 66.99,81.28 64.77,83.5 57.47,83.5 56.52,82.55 v55.24,82.55
  Bottom 0.305: v60.96,61.59 60.96,67.63 v62.87,69.53 | v55.24,82.55 38.73,82.55 JTAG.7
PA14/TCK  (via drill 0.4)
  Top 0.305: STM32.76 51.62,63.82 55.24,63.82 v55.56,64.14 55.88,64.14 R51.2 | v61.91,70.48 66.36,74.93 66.36,80.96 64.45,82.87 58.1,82.87 v56.52,81.28
  Bottom 0.305: v55.56,64.14 v61.91,70.48 | JTAG.9 41.27,80.01 55.24,80.01 v56.52,81.28
PA15/TDI  (via drill 0.4)
  Top 0.305: STM32.77 51.55,64.45 53.98,64.45 v55.56,66.04 56.52,66.04 R48.1 | v60.96,71.44 65.72,76.2 65.72,80.64 64.14,82.23 59.69,82.23 v57.78,80.33
  Bottom 0.305: v55.56,66.04 v60.96,71.44 | JTAG.5 36.83,79.38 56.83,79.38 v57.78,80.33
PB0/ADC12_IN8  (via drill 0.4)
  Top 0.305: STM32.35 34.98,57.78 v36.2,57.78
  Bottom 0.305: v36.2,57.78 34.61,56.2 31.75,56.2 30.16,54.61 14.92,54.61 12.38,57.15 SV1.24
PB1/ADC12_IN9  (via drill 0.4)
  Top 0.305: STM32.36 33.15,55.24 v32.7,55.24
  Bottom 0.305: v32.7,55.24 31.75,55.24 30.48,53.98 13.97,53.98 12.06,55.88 8.26,55.88 SV1.23
PB3/TDO
  Top 0.305: JTAG.13 45.85,80.52 R36.1 46.8,78.42 57.78,78.42 60.96,81.6 63.82,81.6 65.09,80.33 65.09,76.83 60.64,72.39 51,72.39 STM32.89
PB4/TRST
  Top 0.305: JTAG.3 32.38,79.88 32.29,79.79 | 32.29,79.79 R49.1 | STM32.90 50.93,73.03 60.33,73.03 64.45,77.15 64.45,80.01 63.5,80.96 61.59,80.96 58.42,77.79 38.42,77.79 36.51,79.69 32.38,79.69 32.29,79.79
PB5  (via drill 0.4)
  Top 0.305: STM32.91 51.75,74.56 v51.75,74.61
  Bottom 0.305: SV1.38 33.02,74.93 33.66,74.3 42.23,74.3 44.13,72.39 49.53,72.39 v51.75,74.61
PB6  (via drill 0.4)
  Top 0.305: STM32.92 50.16,73.66 50.16,74.3 v50.48,74.61
  Bottom 0.305: v50.48,74.61 48.9,73.03 44.45,73.03 42.55,74.93 34.29,74.93 33.02,76.2 8.26,76.2 SV1.39
PB7  (via drill 0.4)
  Top 0.305: STM32.93 49.21,73.43 v49.21,74.61
  Bottom 0.305: v49.21,74.61 48.26,73.66 44.77,73.66 42.86,75.56 34.92,75.56 33.02,77.47 SV1.40
PB8/I2C1_SCL  (via drill 0.4)
  Top 0.305: STM32.95 47.62,73.26 47.62,75.25 48.58,76.2 60.01,76.2 v62.87,79.06
  Bottom 0.305: v62.87,79.06 68.26,79.06 71.12,76.2 73.34,76.2 SV2.40 74.61,79.88 R45.2
PB9/I2C1_SDA  (via drill 0.4)
  Top 0.305: STM32.96 46.99,73.33 46.99,75.56 48.26,76.83 59.05,76.83 v62.23,80.01
  Bottom 0.305: v62.23,80.01 69.53,80.01 SV2.39 R39.2
PB10  (via drill 0.4)
  Top 0.305: STM32.47 33.97,48.29 33.97,46.35 v33.34,45.72
  Bottom 0.305: v33.34,45.72 32.38,44.77 17.46,44.77 11.43,38.73 11.43,35.56 10.16,34.29 SV1.6
PB11
  Top 0.305: STM32.48 35.56,49.17 35.56,46.67 33.66,44.77 R16.2
PB12
  Top 0.305: STM32.51 43.5,50.16 43.5,48.9 41.91,47.31 39.69,45.09 38.73,45.09 38.42,45.4 35.88,45.4 35.24,44.77 R19.2
PB13
  Top 0.305: STM32.52 44.13,50.23 44.13,48.58 42.23,46.67 39.81,44.26 R17.2
PB14  (via drill 0.4)
  Top 0.305: STM32.53 44.77,50.31 44.77,48.26 41.59,45.09 v41.59,44.77
  Bottom 0.305: v41.59,44.77 40.96,44.13 18.1,44.13 12.38,38.42 12.38,34.61 10.79,33.02 8.26,33.02 SV1.5
PB15  (via drill 0.4)
  Top 0.305: STM32.54 45.4,50.38 45.4,47.94 43.18,45.72 v43.18,44.77
  Bottom 0.305: v43.18,44.77 41.91,43.5 18.73,43.5 13.34,38.1 13.34,33.97 11.11,31.75 SV1.4
PC0/ADC123_IN10
  Top 0.305: STM32.15 32.15,68.58 10.79,68.58 SV1.32
PC1  (via drill 0.4)
  Top 0.305: STM32.16 32.4,67.63 v31.75,67.63 | v27.3,62.87 26.67,62.23 26.67,48.26 23.81,45.4 R21.2
  Bottom 0.305: v27.3,62.87 31.75,67.31 v31.75,67.63
PC2/ADC123_IN12
  Top 0.305: STM32.17 32.64,66.67 30.48,66.67 29.21,67.94 12.7,67.94 10.79,66.04 8.26,66.04 SV1.31
PC3/ADC123_IN13
  Top 0.305: STM32.18 32.57,66.04 30.16,66.04 28.89,67.31 13.65,67.31 11.11,64.77 SV1.30
PC4
  Top 0.305: STM32.33 29.21,53.43 29.21,46.04 28.57,45.4 R15.2
PC5
  Top 0.305: STM32.34 29.84,53.36 29.84,44.58 R14.2
PC6  (via drill 0.4)
  Top 0.305: STM32.63 53.57,48.58 58.74,48.58 v59.37,49.21
  Bottom 0.305: v59.37,49.21 59.37,45.09 67.63,36.83 SV2.7
PC7  (via drill 0.4)
  Top 0.305: STM32.64 52.69,50.16 52.7,50.16 53.66,49.21 58.1,49.21 59.05,50.16 v60.01,50.16
  Bottom 0.305: v60.01,50.16 60.64,49.53 60.64,45.4 67.94,38.1 73.34,38.1 SV2.8
PC8  (via drill 0.4)
  Top 0.305: STM32.65 53.71,49.85 57.78,49.85 59.05,51.12 60.33,51.12 v61.59,49.85
  Bottom 0.305: v61.59,49.85 61.91,49.53 61.91,45.72 68.26,39.37 SV2.9
PC9  (via drill 0.4)
  Top 0.305: STM32.66 53.78,50.48 57.47,50.48 58.74,51.75 60.96,51.75 v61.59,51.12
  Bottom 0.305: v61.59,51.12 63.18,49.53 63.18,46.04 68.58,40.64 73.34,40.64 SV2.12
PC10  (via drill 0.4)
  Top 0.305: STM32.78 51.79,65.41 v53.66,65.41 | v65.09,67.63 69.53,72.07 69.53,86.04 BOOT/USART3.1
  Bottom 0.305: v53.66,65.41 60.64,72.39 61.28,72.39 63.82,69.85 63.82,68.9 v65.09,67.63
PC11  (via drill 0.4)
  Top 0.305: STM32.79 52.04,66.36 v52.7,66.36 | v64.77,69.22 67.94,72.39 BOOT/USART3.2
  Top 0.406: R52.2 67.94,85.92 BOOT/USART3.2
  Bottom 0.305: v52.7,66.36 53.66,66.36 60.33,73.03 61.59,73.03 64.77,69.85 v64.77,69.22
PC12  (via drill 0.4)
  Top 0.305: STM32.80 48.16,63.18 47.31,63.18 v45.09,65.41
  Bottom 0.305: v45.09,65.41 45.09,68.26 39.69,73.66 8.26,73.66 SV1.37
PC13/STAT_LED1  (via drill 0.4)
  Top 0.305: STM32.7 36.2,70.19 v36.2,70.48 | v48.9,17.46 48.26,16.83 R32.1
  Bottom 0.305: v36.2,70.48 36.83,71.12 40.32,71.12 43.5,67.94 43.5,64.77 50.16,58.1 50.16,18.73 v48.9,17.46
PC14/STAT_LED2  (via drill 0.4)
  Top 0.305: STM32.8 35.24,70.44 v35.24,71.12 | v50.16,14.92 50.99,14.1 R33.1
  Bottom 0.305: v35.24,71.12 35.88,71.75 40.64,71.75 44.13,68.26 44.13,65.09 50.8,58.42 50.8,15.56 v50.16,14.92
PC15/STAT_LED3
  Top 0.305: STM32.9 33.97,71 33.97,72.07 34.61,72.71 34.61,76.83 33.66,77.79 21.59,77.79 18.73,80.64 18.73,81.15 R30.1
PD0
  Top 0.305: STM32.81 51.58,67.31 56.83,67.31 66.99,57.15 SV2.23
PD1
  Top 0.305: STM32.82 51.51,67.94 57.15,67.94 66.67,58.42 73.34,58.42 SV2.24
PD2
  Top 0.305: STM32.83 51.43,68.58 57.47,68.58 66.36,59.69 SV2.25
PD3
  Top 0.305: STM32.84 51.36,69.22 57.78,69.22 66.04,60.96 73.34,60.96 SV2.26
PD4
  Top 0.305: STM32.85 51.29,69.85 58.1,69.85 65.72,62.23 SV2.27
PD5
  Top 0.305: STM32.86 51.22,70.48 58.42,70.48 65.41,63.5 73.34,63.5 SV2.28
PD6
  Top 0.305: STM32.87 51.15,71.12 58.74,71.12 65.09,64.77 SV2.29
PD7
  Top 0.305: STM32.88 51.07,71.75 59.05,71.75 64.77,66.04 73.34,66.04 SV2.30
PD8
  Top 0.305: STM32.55 52.99,43.5 63.5,43.5 66.99,46.99 SV2.15
PD9
  Top 0.305: STM32.56 53.06,44.13 63.18,44.13 67.31,48.26 73.34,48.26 SV2.16
PD10
  Top 0.305: STM32.57 53.13,44.77 62.87,44.77 67.63,49.53 SV2.17
PD11
  Top 0.305: STM32.58 53.21,45.4 62.55,45.4 67.94,50.8 73.34,50.8 SV2.18
PD12
  Top 0.305: STM32.59 53.28,46.04 62.23,46.04 68.26,52.07 SV2.19
PD13
  Top 0.305: STM32.60 53.35,46.67 61.91,46.67 68.58,53.34 73.34,53.34 SV2.20
PD14
  Top 0.305: STM32.61 53.42,47.31 61.59,47.31 68.9,54.61 SV2.21
PD15
  Top 0.305: STM32.62 53.5,47.94 61.28,47.94 69.22,55.88 73.34,55.88 SV2.22
PE0  (via drill 0.4)
  Top 0.305: STM32.97 45.4,72.45 v45.4,74.93
  Bottom 0.305: v45.4,74.93 46.04,75.56 60.01,75.56 66.99,68.58 73.34,68.58 SV2.34
PE1  (via drill 0.4)
  Top 0.305: STM32.98 44.45,72.2 v44.45,75.88
  Bottom 0.305: v44.45,75.88 44.77,76.2 60.33,76.2 66.67,69.85 SV2.33
PE2  (via drill 0.4)
  Top 0.305: v25.4,63.82 25.4,50.16 20.64,45.4 R13.2 | STM32.1 38.1,72.53 38.1,72.71 v38.73,72.71
  Bottom 0.305: v25.4,63.82 26.35,63.82 35.56,73.03 38.42,73.03 v38.73,72.71
PE3  (via drill 0.4)
  Top 0.305: STM32.2 37.15,72.78 37.15,75.25 v38.42,76.52
  Bottom 0.305: v38.42,76.52 38.73,76.83 60.64,76.83 66.36,71.12 73.34,71.12 SV2.36
PE4  (via drill 0.4)
  Top 0.305: STM32.3 36.51,72.7 36.51,76.2 v37.47,77.15
  Bottom 0.305: v37.47,77.15 37.78,77.47 60.96,77.47 66.04,72.39 SV2.35
PE5  (via drill 0.4)
  Top 0.305: STM32.4 35.88,72.63 35.88,77.15 v36.51,77.79
  Bottom 0.305: v36.51,77.79 36.83,78.11 61.28,78.11 65.72,73.66 73.34,73.66 SV2.38
PE6  (via drill 0.4)
  Top 0.305: STM32.5 35.24,72.56 35.24,78.42 v35.56,78.74
  Bottom 0.305: v35.56,78.74 61.59,78.74 65.41,74.93 SV2.37
PE7  (via drill 0.4)
  Top 0.305: STM32.38 32.66,53.34 v31.43,53.34
  Bottom 0.305: v31.43,53.34 14.61,53.34 10.79,49.53 SV1.18
PE8  (via drill 0.4)
  Top 0.305: STM32.39 32.41,52.39 v30.8,52.39
  Bottom 0.305: v30.8,52.39 14.92,52.39 10.79,48.26 8.26,48.26 SV1.17
PE9  (via drill 0.4)
  Top 0.305: STM32.40 32.17,51.44 v31.43,51.44
  Bottom 0.305: v31.43,51.44 15.24,51.44 10.79,46.99 SV1.16
PE10  (via drill 0.4)
  Top 0.305: STM32.41 31.92,50.48 v30.8,50.48
  Bottom 0.305: v30.8,50.48 15.56,50.48 10.79,45.72 8.26,45.72 SV1.15
PE11  (via drill 0.4)
  Top 0.305: STM32.42 31.68,49.53 v31.43,49.53
  Bottom 0.305: v31.43,49.53 15.88,49.53 10.79,44.45 SV1.14
PE12  (via drill 0.4)
  Top 0.305: STM32.43 31.43,48.58 v30.8,48.58
  Bottom 0.305: v30.8,48.58 16.19,48.58 10.79,43.18 8.26,43.18 SV1.13
PE13  (via drill 0.4)
  Top 0.305: STM32.44 31.82,48.26 v31.75,47.62
  Bottom 0.305: v31.75,47.62 16.51,47.62 10.79,41.91 SV1.12
PE14  (via drill 0.4)
  Top 0.305: STM32.45 32.7,48.44 32.7,47.31 32.07,46.67 v31.11,46.67
  Bottom 0.305: v31.11,46.67 16.83,46.67 10.79,40.64 8.26,40.64 SV1.11
PE15  (via drill 0.4)
  Top 0.305: STM32.46 33.34,48.36 33.34,46.99 v32.07,45.72
  Bottom 0.305: v32.07,45.72 17.14,45.72 10.79,39.37 SV1.10
RESET
  Top 0.305: STM32.14 32.22,69.22 23.5,69.22 13.34,79.38 12.06,79.38 10.99,80.45 C1.2 R31.2 9.34,83.53 RESET.1 11.27,86.04 45.09,86.04 46.35,85.09 46.35,82.55 JTAG.15
RX_N
  Top 0.305: U2.22 21.84,20.06 22.86,19.04 RJ1.RD-
  Bottom 0.305: RJ1.RD- R27.2
RX_P
  Top 0.305: U2.23 22.34,20.21 24.13,18.42 24.13,16.51 23.5,15.88 20.32,15.88 RJ1.RD+
  Bottom 0.305: RJ1.RD+ 20.64,13.02 R26.2
RXD0
  Top 0.305: U2.8 22.34,32.5 23.18,33.34 25.72,33.34 27.62,35.24 JP2.9 27.62,38.42 28.89,39.69 28.89,42.42 R15.1
RXD1
  Top 0.305: U2.7 22.84,32.05 23.5,32.7 26.04,32.7 28.89,35.56 28.89,38.42 30.16,39.69 JP2.12 R14.1
RXER
  Top 0.305: U2.10 21.34,33.41 22.54,34.61 24.45,34.61 26.35,36.51 26.35,38.42 27.62,39.69 JP2.10
TX_N
  Top 0.305: U2.20 20.84,20.53 17.78,17.47 RJ1.TD-
  Bottom 0.305: RJ1.TD- 17.78,13.97 19.05,12.7 R25.2
TX_P
  Top 0.305: U2.21 21.34,20.38 19.05,18.09 19.05,16.51 18.41,15.88 17.78,15.88 RJ1.TD+
  Bottom 0.305: RJ1.TD+ 16.51,13.14 R8.2
TXD0  (via drill 0.4)
  Top 0.305: U2.17 16.94,28.14 15.88,29.21 15.88,34.61 17.46,36.2 JP2.1 | v36.2,41.27 35.24,42.23 R19.1
  Bottom 0.305: JP2.1 18.73,39.05 18.73,41.27 19.68,42.23 35.24,42.23 v36.2,41.27
TXD1  (via drill 0.4)
  Top 0.305: U2.18 16.49,27.64 15.24,28.89 15.24,38.1 JP2.2 | v37.78,41.27 36.83,42.23 R17.1
  Bottom 0.305: JP2.2 17.46,40.96 19.37,42.86 36.2,42.86 v37.78,41.27
TXEN  (via drill 0.4)
  Top 0.305: U2.16 17.39,28.64 16.51,29.53 16.51,34.29 18.73,36.51 18.73,39.05 JP2.4 | v34.61,41.27 33.66,42.23 R16.1
  Bottom 0.305: JP2.4 20,40.96 20.64,41.59 34.29,41.59 v34.61,41.27
USB_DET  (via drill 0.4)
  Top 0.305: STM32.68 52.66,53.02 53.34,53.02 v53.98,52.39 | R41.2 37.15,14.61 39.05,16.51 39.05,25.08 53.98,40.01 v53.98,40.32
  Bottom 0.305: v53.98,40.32 v53.98,52.39
USB_ID  (via drill 0.4)
  Top 0.305: STM32.69 52.73,53.66 v57.78,53.66 | R24.2 41.91,15.24 40.96,16.19 40.96,22.54 57.78,39.37 v58.42,39.37
  Bottom 0.305: v58.42,39.37 58.42,53.66 v57.78,53.66
USB_N  (via drill 0.4)
  Top 0.305: STM32.70 52.08,55.02 53.02,55.02 v53.02,54.63 | R2.2 38.73,14.52 39.78,15.56 39.78,23.91 55.97,40.1 v55.59,40.26
  Bottom 0.305: v53.02,54.63 53.02,55.02 55.47,55.02 55.97,54.52 55.97,40.1 v55.59,40.26
USB_P  (via drill 0.4)
  Top 0.305: STM32.71 52.33,55.47 53.02,55.47 v53.02,55.85 | R3.2 40.32,15.47 40.23,15.56 40.23,23.72 56.43,39.91 v56.78,39.77
  Bottom 0.305: v53.02,55.85 53.02,55.47 55.66,55.47 56.43,54.7 56.43,39.91 v56.78,39.77
VBAT  (via drill 0.4)
  Top 0.305: STM32.6 38.52,68.58 v39.69,68.58
  Bottom 0.305: v39.69,68.58 40.13,68.58 R38.2
VDDA  (via drill 0.4)
  Top 0.305: STM32.22 33.02,62.76 v33.02,61.59
  Bottom 0.305: v33.02,61.59 L3.2 34.54,61.37 R29.1 37.26,60.09 C13.1 38.47,61.18 C22.1
VDDA_PHY  (via drill 0.4)
  Top 0.305: U2.19 20.34,25.4 | 20.34,25.4 20.34,24.45 | 20.34,24.45 20.34,22.74 L1.1 | 20.34,24.45 20.18,24.29 C25.1 16.68,24.29 C26.1 | U2.1 25.06,27.64 26.04,26.67 v26.04,25.08 26.04,23.62 C29.1 | v19.37,25.4 20.34,25.4
  Top 0.406: L1.1 19.05,21.45 19.05,20.32 14.61,15.88 14.61,13.65 16.19,12.06 20.64,12.06 21.59,13.02 RJ1.P5
  Bottom 0.305: v26.04,25.08 21.56,25.08 | 21.56,25.08 C27.1 | 21.56,25.08 19.68,25.08 v19.37,25.4 | 21.59,10.67 R26.1 R25.1 R8.1 | 21.59,10.67 R27.1 | 21.59,10.67 RJ1.P5 20.32,15.88 RJ1.P4 20.32,18.16 C15.1
VDDCR
  Top 0.305: U2.6 24.77,30.14 | 24.77,30.14 27.85,30.14 C21.1 | C17.1 24.86,30.23 24.77,30.14
VIN
  Top 0.813: R40.1 77.47,16.51 79.69,18.73 79.69,26.04 76.52,29.21 SV2.2 SV2.1
  Bottom 0.305: D1.C 65.09,18.67 65.09,18.73
  Bottom 0.813: JP1.3 72.07,27.94 SV2.1
  Bottom 1.016: SV2.2 SV2.1 72.07,25.72 65.09,18.73
VREF+  (via drill 0.4)
  Top 0.305: STM32.21 33.94,62.55 v34.29,62.23
  Bottom 0.305: v34.29,62.23 35.56,62.23 36.2,62.87 36.51,62.87 36.93,62.45 R29.2 37.88,63.28 C28.1
VREF-  (via drill 0.4)
  Top 0.305: STM32.20 34.01,63.18 v35.24,63.18
  Bottom 0.305: v35.24,63.18 36.42,64.36 C28.2 37.66,64.77 38.1,64.77 40.1,62.77 R28.2
XTAL1
  Top 0.305: Q3.2 31.86,30.81 C12.2 R4.2 30.19,29.64 U2.5
XTAL2
  Top 0.305: Q3.1 31.86,26.51 C11.2 R4.1 30.37,27.94 29.84,27.94 28.64,29.14 U2.4

### Text on the board
Unrouted: STM32407VE ARM VE INTERNET,YAPAY ZEKA GELİŞTİRME KART
tNames: PB6 | PB9 | PB7 | PB8 | PC12 | PE6 | PB5 | PE5 | +3.3V | PE4 | +3.3V | PE3 | GND | PE1 | GND | PE0 | PC2 | GND | PC0 | GND | PA0 | PD6 | PC3 | PD7 | PA4 | PD4 | PA3 | PD5 | PA6 | PD2 | PA5 | PD3 | PB1 | PD0 | PB0 | PD1 | GND | PD14 | GND | PD15 | +3.3V | PD12 | +3.3V | PD13 | PE8 | PD10 | PE7 | PD11 | PE10 | PD8 | PE9 | PD9 | PE12 | GND | PE11 | GND | PE14 | PA8 | PE13 | PC9 | GND | PC8 | PE15 | PC7 | GND | PC6 | GND | GND | PB14 | GND | PB10 | GND | GND | +3.3V | PB15 | +3.3V | GND | GND | 3.3V | VIN | VIN | GND | VIN
bNames: RX | TX | 3.3V | Gnd | USART3 | PB7 | I2C1 | PB8 | PB6 | PB9 | RX | SCL | TX | PB5 | SDA | PE5 | PC12 | USART1 | PE6 | +3.3V | PE3 | +3.3V | PE4 | GND | PE0 | GND | PE1 | PC0 | GND | PC2 | GND | ANALOG | PC3 | PD7 | PA0 | PD6 | PA3 | PD5 | PA4 | PD4 | PA5 | PD3 | PA6 | PD2 | PB0 | PD1 | PB1 | PD0 | GND | PD15 | GND | PD14 | +3.3V | PD13 | +3.3V | PD12 | PE7 | PD11 | PE8 | PD10 | PE9 | PD9 | PE10 | PD8 | PE11 | GND | PE12 | I2C3 | GND | PE13 | PC9 | PA8 | SCL | PE14 | SDA | PE15 | GND | GND | USART6 | PC8 | PC7 | GND | PC6 | RX | GND | TX | PB10 | GND | PB14 | GND | PB15 | +3.3V | GND | +3.3V | GND | GND | 3.3V | VIN | VIN | GND | VIN